# Altium project B100BA.PrjPcb (part 3 of 6)

## Sheet Bidirectional Voltage Translator.SchDoc: 3V3 - 1V8 Voltage Level Translator
size 292 x 193 mm; ApprovedBy: M. Günce Akkoyun; CheckedBy: M. Günce Akkoyun; Author: M. Günce Akkoyun; CompanyName: Ovoo Electronics; DrawnBy: M. Günce Akkoyun; Engineer: M. Günce Akkoyun; Organization: Ovoo Electronics; Address1: Necip Fazıl Mah. Ortaırmak Sok.; Address2: Birgül Apt. No: 19/6; Address3: Meram / Konya; Address4: Turkiye; DocumentNumber: 11; Revision: R01; SheetNumber: 9; SheetTotal: 44
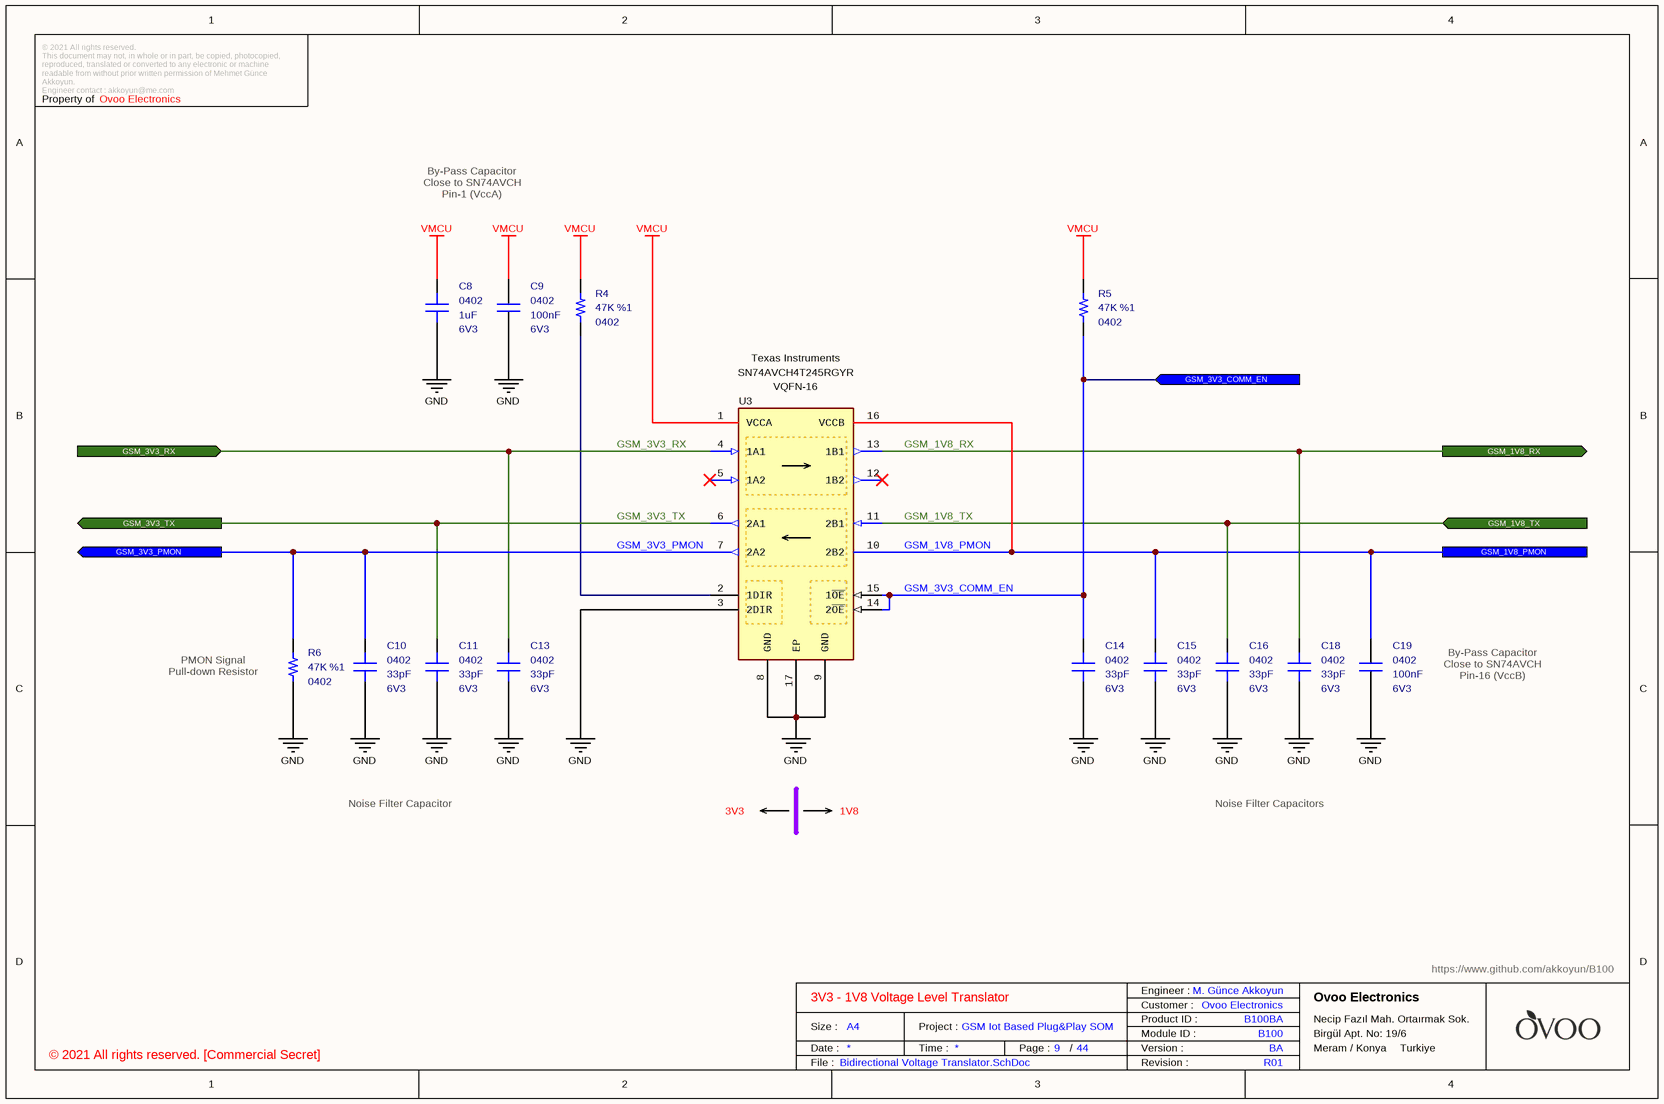
[diagram p12: Bidirectional Voltage Translator.SchDoc]

### Parts
C8  value 1uF  Case: 0402  Voltage: 6V3  [CAPACITOR_0402]  (hidden comment: Multilayer Ceramic Capacitor)
C9  value 100nF  Case: 0402  Voltage: 6V3  [CAPACITOR_0402]  (hidden comment: Multilayer Ceramic Capacitor)
C10  value 33pF  Case: 0402  Voltage: 6V3  [CAPACITOR_0402]  (hidden comment: Multilayer Ceramic Capacitor)
C11  value 33pF  Case: 0402  Voltage: 6V3  [CAPACITOR_0402]  (hidden comment: Multilayer Ceramic Capacitor)
C13  value 33pF  Case: 0402  Voltage: 6V3  [CAPACITOR_0402]  (hidden comment: Multilayer Ceramic Capacitor)
C14  value 33pF  Case: 0402  Voltage: 6V3  [CAPACITOR_0402]  (hidden comment: Multilayer Ceramic Capacitor)
C15  value 33pF  Case: 0402  Voltage: 6V3  [CAPACITOR_0402]  (hidden comment: Multilayer Ceramic Capacitor)
C16  value 33pF  Case: 0402  Voltage: 6V3  [CAPACITOR_0402]  (hidden comment: Multilayer Ceramic Capacitor)
C18  value 33pF  Case: 0402  Voltage: 6V3  [CAPACITOR_0402]  (hidden comment: Multilayer Ceramic Capacitor)
C19  value 100nF  Case: 0402  Voltage: 6V3  [CAPACITOR_0402]  (hidden comment: Multilayer Ceramic Capacitor)
R4  value 47K  Tolerance: %1  Case: 0402  [RESISTOR_0402]  (hidden comment: Thick Film Resistor)
R5  value 47K  Tolerance: %1  Case: 0402  [RESISTOR_0402]  (hidden comment: Thick Film Resistor)
R6  value 47K  Tolerance: %1  Case: 0402  [RESISTOR_0402]  (hidden comment: Thick Film Resistor)
U3  Manufacturer_Name: Texas Instruments  Manufacturer Part Number: SN74AVCH4T245RGYR  Case: VQFN-16  [VQFN16]  (hidden comment: Voltage Level Shifter)

### Ports
GSM_1V8_PMON, GSM_1V8_RX (out), GSM_1V8_TX (in), GSM_3V3_COMM_EN (in), GSM_3V3_PMON (out), GSM_3V3_RX (in), GSM_3V3_TX (out)

### Nets
GND: C8.1 C9.1 C10.1 C11.1 C13.1 C14.1 C15.1 C16.1 C18.1 C19.1 R6.1 U3.3(2DIR) U3.8(GND) U3.9(GND) U3.17(EP)
VMCU: C8.2 C9.2 R4.2 R5.2 U3.1(VCCA)
GSM_1V8_PMON: C15.2 C19.2 U3.10(2B2) U3.16(VCCB) ; port GSM_1V8_PMON
GSM_1V8_RX: C18.2 U3.13(1B1) ; port GSM_1V8_RX
GSM_1V8_TX: C16.2 U3.11(2B1) ; port GSM_1V8_TX
GSM_3V3_COMM_EN: C14.2 R5.1 U3.14(2~{OE}) U3.15(1~{OE}) ; port GSM_3V3_COMM_EN
GSM_3V3_PMON: C10.2 R6.2 U3.7(2A2) ; port GSM_3V3_PMON
GSM_3V3_RX: C13.2 U3.4(1A1) ; port GSM_3V3_RX
GSM_3V3_TX: C11.2 U3.6(2A1) ; port GSM_3V3_TX
NetR4_1: R4.1 U3.2(1DIR)

Not connected (* = marked no-connect by the designer): U3 5(1A2)* 12(1B2)*

### Notes on the sheet
- By-Pass Capacitor
  Close to SN74AVCH
  Pin-1 (VccA)
- (near R6) PMON Signal
  Pull-down Resistor
- By-Pass Capacitor
  Close to SN74AVCH
  Pin-16 (VccB)
- Noise Filter Capacitor
- 3V3
- 1V8
- Noise Filter Capacitors
- © 2021 All rights reserved.
  This document may not, in whole or in part, be copied, photocopied, reproduced, translated or converted to any electronic or machine readable from without prior written permission of Mehmet Günce Akkoyun.
  Engineer contact : akkoyun@me.com
- Property of
- Engineer :
- Date :
- Size :
- A4
- Time :
- Project :
- Page :
- /
- Customer :
- Product ID :
- Module ID :
- Version :
- File :
- Revision :

### Library data of the parts
C8 = Capacitor - 1uF [0402-6V3): Capacitor - 1uF [0402] (Ceramic); Manufacturer_Name: Murata Electronics; Manufacturer_Part_Number: GRM153R60J105ME95D; Dielectric: X5R; Tolerance: 20%; Height: 0.3mm; Mouser_Part_Number: 81-GRM153R60J105ME5D; Maximum Operating Temperature: +85; Minimum Operating Temperature: -55; RoHS: Yes; Weight: 6mg; ComponentLink1Description: DataSheet; ComponentLink1URL: https://psearch.en.murata.com/capacitor/product/GRM153R60J105ME95%23.html; ComponentLink2Description: Mouser; ComponentLink2URL: https://www.mouser.com/Search/Refine.aspx?Keyword=81-GRM153R60J105ME5D; Supplier 1: Future Electronics; Supplier 2: Future Electronics; Supplier 3: Mouser; Supplier 4: Arrow; Supplier 5: Digi-Key; Supplier Part Number 5: 490-14576-1-ND; Supplier Part Number 4: GRM153R60J105ME95D; Supplier Part Number 3: 81-GRM153R60J105ME5D; Supplier Part Number 2: GRM153R60J105ME95D-REEL; Supplier Part Number 1: GRM153R60J105ME95D-CUTT
C9 C19 = Capacitor - 100nF [0402-6V3]: Capacitor - 100nF [0402-6V3] (Ceramic); Manufacturer_Name: AVX; Manufacturer_Part_Number: 04026D104KAT4A; Dielectric: X5R; Tolerance: %10; Height: 0.25mm; Mouser_Part_Number: 581-04026D104KAT4A; ComponentLink1Description: Mouser; ComponentLink1URL: https://www.mouser.com.tr/ProductDetail/AVX/04026D104KAT4A?qs=sGAEpiMZZMs0AnBnWHyRQPg4iYkCw7IMED%2F4kpqgf7w%3D; ComponentLink2Description: DataSheet; ComponentLink2URL: https://www.mouser.com.tr/datasheet/2/40/cx5r-776519.pdf; ROHS: Yes; Maximum Operating Temperature: +85; Minimum Operating Temperature: -55; Supplier 1: Avnet; Supplier Part Number 1: 04026D104KAT4A
C10 C11 C13-C16 C18 = Capacitor - 33pF [0402-6V3]: Capacitor - 33pF [0402] (Ceramic); Manufacturer_Name: Kemet; Manufacturer_Part_Number: C0402C330J9RACAUTO; Dielectric: X7R; Tolerance: 10%; Height: 0.5mm; Mouser_Part_Number: 80-C0402C330J9RAUTO; Maximum Operating Temperature: +125; Minimum Operating Temperature: -55; ROHS: Yes; ComponentLink1Description: DataSheet; ComponentLink1URL: https://api.kemet.com/component-edge/download/datasheet/C0402C330J9RACAUTO.pdf; ComponentLink2Description: Mouser; ComponentLink2URL: https://www.mouser.com/Search/Refine.aspx?Keyword=80-C0402C330J9RAUTO; Supplier 1: Mouser; Supplier Part Number 1: 80-C0402C330J9RAUTO
R4-R6 = Resistor - 47K: Thick Film Resistors - SMD 1/16 W 47 Kohms 1%; Manufacturer_Name: Vishay; Manufacturer_Part_Number: CRCW040247K0FKED; Height: 0.4mm; Mouser_Part_Number: 71-CRCW0402-47K-E3; ComponentLink1Description: DataSheet; ComponentLink1URL: https://www.mouser.com.tr/datasheet/2/427/dcrcwe3-1762152.pdf; ComponentLink2Description: Mouser; ComponentLink2URL: https://www.mouser.com.tr/ProductDetail/Vishay-Dale/CRCW040247K0FKED?qs=sGAEpiMZZMu61qfTUdNhG2DpbjADlD3GL%252B3h1elTxqU%3D; Supplier 1: Mouser; Supplier 2: Digi-Key; Supplier Part Number 1: 71-CRCW040247K0FKEDH; Supplier Part Number 2: 541-47.0KYCT-ND
U3 = IC - SN74AVCH4T245: Translation - Voltage Levels Low Power Dual Channel; Supply Voltage - Max: 3.6V; Supply Voltage - Min: 1.2V; Height: 1mm; Mouser_Part_Number: 595-SN74AVCH4T245RGY; ComponentLink1Description: DataSheet; ComponentLink1URL: http://www.ti.com/general/docs/suppproductinfo.tsp?distId=26&gotoUrl=http%3A%2F%2Fwww.ti.com%2Flit%2Fgpn%2Fsn74avch4t245; Maximum Operating Temperature: +85; Minimum Operating Temperature: -40; ComponentLink2Description: Mouser; ComponentLink2URL: https://www.mouser.com.tr/ProductDetail/Texas-Instruments/SN74AVCH4T245RGYR?qs=PVVDbbWpW3IMTHF1QV2g%252BQ==; Supplier 1: Mouser; Supplier 2: Arrow; Supplier 3: Digi-Key; Supplier Part Number 1: 595-SN74AVCH4T245RGY; Supplier Part Number 2: SN74AVCH4T245RGYR; Supplier Part Number 3: 296-18262-1-ND

## Sheet GSM LED Driver.SchDoc: GSM LED Inducators Driver
size 393 x 281 mm; SheetNumber: 13; SheetTotal: 44
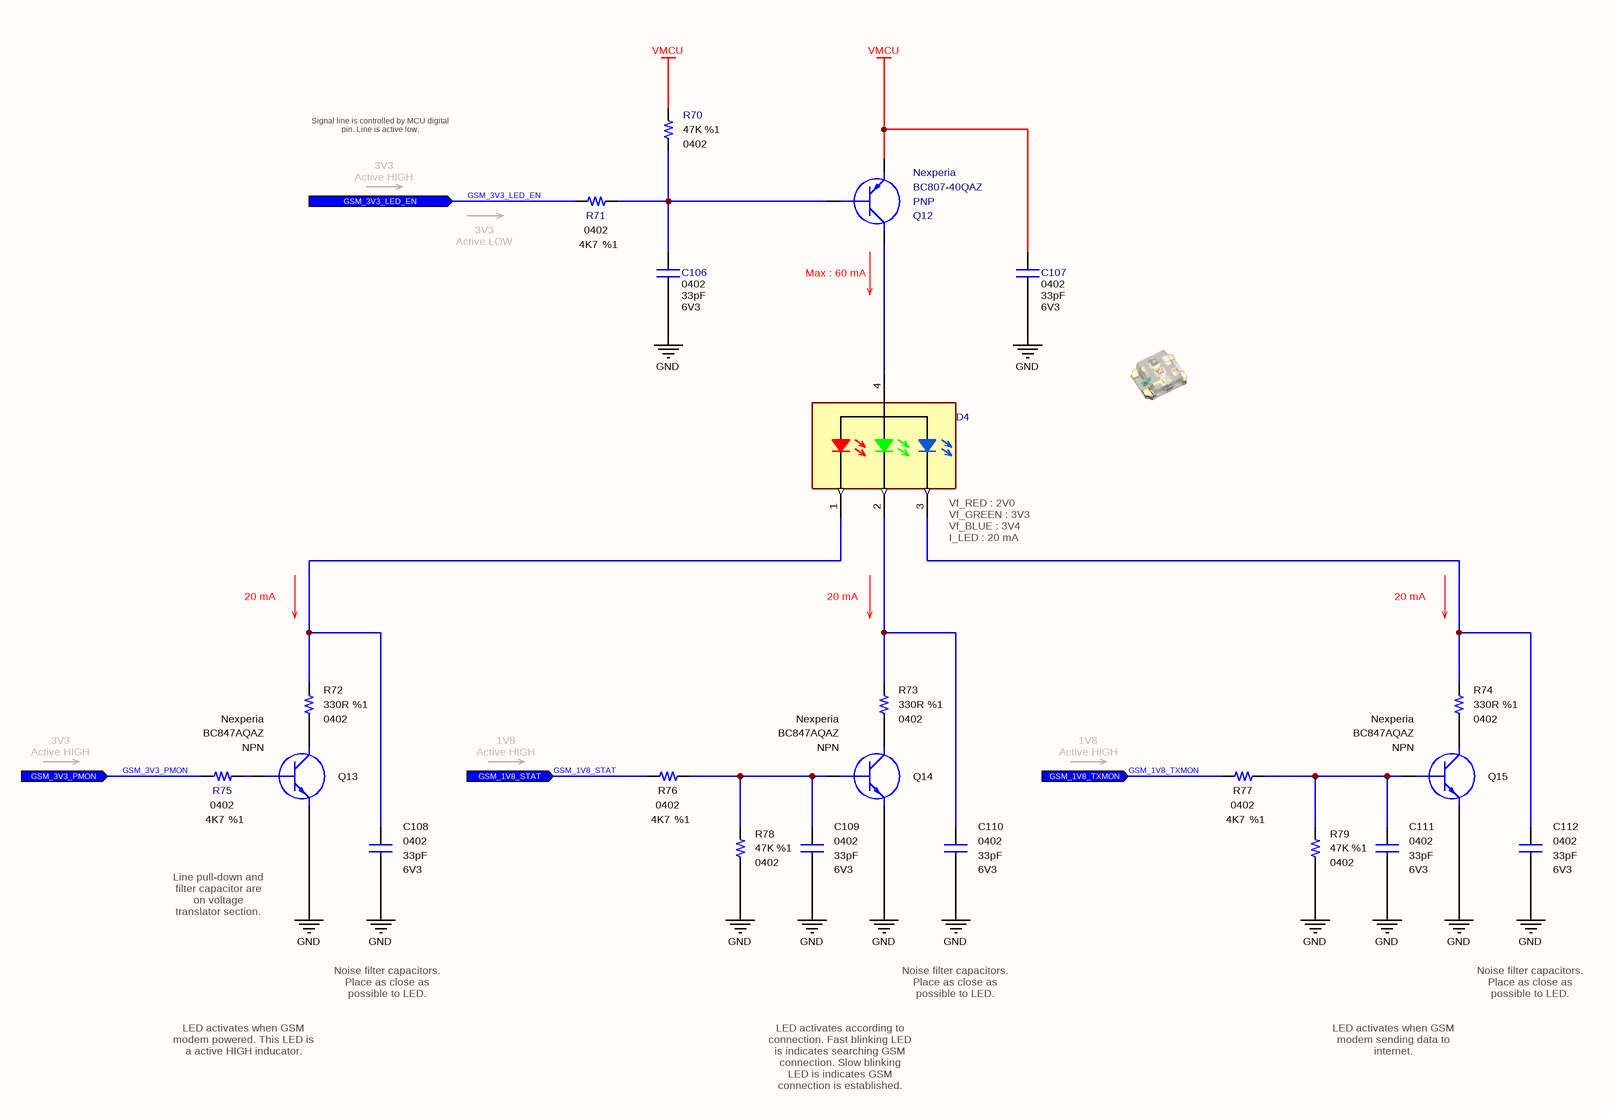
[diagram p13: GSM LED Driver.SchDoc]

### Parts
C106  value 33pF  Case: 0402  Voltage: 6V3  [CAPACITOR_0402]  (hidden comment: Multilayer Ceramic Capacitor)
C107  value 33pF  Case: 0402  Voltage: 6V3  [CAPACITOR_0402]  (hidden comment: Multilayer Ceramic Capacitor)
C108  value 33pF  Case: 0402  Voltage: 6V3  [CAPACITOR_0402]  (hidden comment: Multilayer Ceramic Capacitor)
C109  value 33pF  Case: 0402  Voltage: 6V3  [CAPACITOR_0402]  (hidden comment: Multilayer Ceramic Capacitor)
C110  value 33pF  Case: 0402  Voltage: 6V3  [CAPACITOR_0402]  (hidden comment: Multilayer Ceramic Capacitor)
C111  value 33pF  Case: 0402  Voltage: 6V3  [CAPACITOR_0402]  (hidden comment: Multilayer Ceramic Capacitor)
C112  value 33pF  Case: 0402  Voltage: 6V3  [CAPACITOR_0402]  (hidden comment: Multilayer Ceramic Capacitor)
D4  150066M153000  [Wurth_0606]  (value not drawn)
Q12  Polarity: PNP  Manufacturer Name: Nexperia  Manufacturer Part Number: BC807-40QAZ  [SOT1215]  (hidden comment: Bipolar PNP Transistors)
Q13  Polarity: NPN  Manufacturer Name: Nexperia  [SOT1215]  (hidden comment: BC847AQAZ)
Q14  Polarity: NPN  Manufacturer Name: Nexperia  [SOT1215]  (hidden comment: BC847AQAZ)
Q15  Polarity: NPN  Manufacturer Name: Nexperia  [SOT1215]  (hidden comment: BC847AQAZ)
R70  value 47K  Tolerance: %1  Case: 0402  [RESISTOR_0402]  (hidden comment: 47K - 0402 - %1 - 1/16W)
R71  value 4K7  Tolerance: %1  Case: 0402  [RESISTOR_0402]  (hidden comment: Thick Film Resistor)
R72  value 330R  Case: 0402  Tolerance: %1  [RESISTOR_0402]  (hidden comment: 330R - 0402 - %1 - 1/16W)
R73  value 330R  Case: 0402  Tolerance: %1  [RESISTOR_0402]  (hidden comment: 330R - 0402 - %1 - 1/16W)
R74  value 330R  Case: 0402  Tolerance: %1  [RESISTOR_0402]  (hidden comment: 330R - 0402 - %1 - 1/16W)
R75  value 4K7  Tolerance: %1  Case: 0402  [RESISTOR_0402]  (hidden comment: Thick Film Resistor)
R76  value 4K7  Tolerance: %1  Case: 0402  [RESISTOR_0402]  (hidden comment: Thick Film Resistor)
R77  value 4K7  Tolerance: %1  Case: 0402  [RESISTOR_0402]  (hidden comment: Thick Film Resistor)
R78  value 47K  Tolerance: %1  Case: 0402  [RESISTOR_0402]  (hidden comment: 47K - 0402 - %1 - 1/16W)
R79  value 47K  Tolerance: %1  Case: 0402  [RESISTOR_0402]  (hidden comment: 47K - 0402 - %1 - 1/16W)

### Ports
GSM_1V8_STAT (in), GSM_1V8_TXMON (in), GSM_3V3_LED_EN (in), GSM_3V3_PMON (in)

### Nets
GND: C106.2 C107.2 C108.2 C109.2 C110.2 C111.2 C112.2 Q13.2(E) Q14.2(E) Q15.2(E) R78.1 R79.1
VMCU: C107.1 Q12.2(E) R70.2
GSM_1V8_STAT: R76.2 ; port GSM_1V8_STAT
GSM_1V8_TXMON: R77.2 ; port GSM_1V8_TXMON
GSM_3V3_LED_EN: R71.2 ; port GSM_3V3_LED_EN
GSM_3V3_PMON: R75.2 ; port GSM_3V3_PMON
NetC106_1: C106.1 Q12.1(B) R70.1 R71.1
NetC108_1: C108.1 D4.1 R72.2
NetC109_1: C109.1 Q14.1(B) R76.1 R78.2
NetC110_1: C110.1 D4.2 R73.2
NetC111_1: C111.1 Q15.1(B) R77.1 R79.2
NetC112_1: C112.1 D4.3 R74.2
NetD4_4: D4.4 Q12.3(C)
NetQ13_1: Q13.1(B) R75.1
NetQ13_3: Q13.3(C) R72.1
NetQ14_3: Q14.3(C) R73.1
NetQ15_3: Q15.3(C) R74.1

### Notes on the sheet
- Signal line is controlled by MCU digital pin. Line is active low.
- 3V3
  Active HIGH
- 3V3
  Active LOW
- (near Q12) Max : 60 mA
- (near D4) Vf_RED : 2V0
  Vf_GREEN : 3V3
  Vf_BLUE : 3V4
  I_LED : 20 mA
- 20 mA
- 1V8
  Active HIGH
- Line pull-down and filter capacitor are on voltage translator section.
- Noise filter capacitors. Place as close as possible to LED.
- LED activates when GSM modem powered. This LED is a active HIGH inducator.
- LED activates according to connection. Fast blinking LED is indicates searching GSM connection. Slow blinking LED is indicates GSM connection is established.
- LED activates when GSM modem sending data to internet.
- © 2021 All rights reserved.
  This document may not, in whole or in part, be copied, photocopied, reproduced, translated or converted to any electronic or machine readable from without prior written permission of Mehmet Günce Akkoyun.
  Engineer contact : akkoyun@me.com
- Property of
- Engineer :
- Date :
- Size :
- A3
- Time :
- Project :
- Page :
- /
- Customer :
- Product ID :
- Module ID :
- Version :
- File :
- Revision :

### Library data of the parts
C106-C112 = Capacitor - 33pF [0402-6V3]: as C66 on sheet 3V8 Buck Boost Converter; Height: 0.5mm; Maximum Operating Temperature: +125; Minimum Operating Temperature: -55; ROHS: Yes; ComponentLink1Description: DataSheet; ComponentLink1URL: https://api.kemet.com/component-edge/download/datasheet/C0402C330J9RACAUTO.pdf; ComponentLink2Description: Mouser; ComponentLink2URL: https://www.mouser.com/Search/Refine.aspx?Keyword=80-C0402C330J9RAUTO; Supplier 1: Mouser; Supplier Part Number 1: 80-C0402C330J9RAUTO; Mouser Part Number: 80-C0402C330J9RAUTO
D4 = Diode - RGB LED (150066M153000): Standard LEDs - SMD PICOLED series Red LED; Manufacturer Name: Wurth Elektronik; Datasheet Link: https://www.mouser.com.tr/datasheet/2/445/150066M153000-1715259.pdf; Manufacturer Part Number: 150066M153000; Mouser Part Number: 710-150066M153000; Mouser Price/Stock: https://www.mouser.com.tr/ProductDetail/ROHM-Semiconductor/SML-P12U2TT86R?qs=sGAEpiMZZMseGfSY3csMkRIBDsfU3UCXJTULB5gem9Ta%252Bp%252BvZ709fg%3D%3D; Case: 0606; ROHS: Yes; Supplier 1: RSComponents; Supplier 2: RSComponents; Supplier 3: Mouser; Supplier 4: Farnell; Supplier 5: Digi-Key; Supplier 6: Digi-Key; Supplier 7: Digi-Key; Supplier 8: Newark; Supplier Part Number 1: 1765006; Supplier Part Number 2: 1766050; Supplier Part Number 3: 710-150066M153000; Supplier Part Number 4: 2764964; Supplier Part Number 5: 732-11390-1-ND; Supplier Part Number 6: 732-11390-6-ND; Supplier Part Number 7: 732-11390-2-ND; Supplier Part Number 8: 22AC3253
Q12 = Transistor - BC807: Bipolar Transistors - BJT 45 V, 500 mA PNP gen purpose transistors; Mouser Part Number: 771-BC807-40QAZ; ComponentLink1Description: DataSheet; ComponentLink1URL: https://www.mouser.com.tr/datasheet/2/916/BC807-25QA_40QA-1665956.pdf; ComponentLink2Description: Mouser; ComponentLink2URL: https://www.mouser.com.tr/ProductDetail/Nexperia/BC807-40QAZ?qs=sGAEpiMZZMshyDBzk1%2FWi8mfWMj7sMzapbI3Mu1S6AqR9y7krhZTdA%3D%3D; Supplier 1: Mouser; Supplier 2: Arrow; Supplier 3: Digi-Key; Supplier 4: Digi-Key; Supplier Part Number 1: 771-BC807-40QAZ; Supplier Part Number 2: BC807-40QAZ; Supplier Part Number 3: 1727-2242-1-ND; Supplier Part Number 4: 1727-2242-6-ND; Case: DFN-1010D-3
Q13-Q15 = Transistor - BC847: Bipolar NPN Transistors; Case: DFN-1010D-3; Supplier 1: Digi-Key; Supplier 2: Digi-Key; Supplier Part Number 1: 1727-2545-1-ND; Supplier Part Number 2: 1727-2545-6-ND; Manufacturer Part Number: BC847AQAZ; Supplier 3: Avnet; Supplier 4: Arrow Electronics; Supplier 5: Mouser; Supplier 6: Newark; Supplier 7: Digi-Key; Supplier 8: Farnell; Supplier 9: Farnell; Supplier Part Number 3: BC847AQAZ; Supplier Part Number 4: BC847AQAZ; Supplier Part Number 5: 771-BC847AQAZ; Supplier Part Number 6: 82Y6125; Supplier Part Number 7: 1727-2545-2-ND; Supplier Part Number 8: 2545344; Supplier Part Number 9: 2545344RL
R70 R78 R79 = Resistor - 47K: Thick Film Resistors - SMD 1/16 W 47 Kohms 1%; Manufacturer Name: Vishay; Manufacturer Part Number: CRCW040247K0FKED; Height: 0.4mm; ComponentLink1Description: DataSheet; ComponentLink1URL: https://www.mouser.com.tr/datasheet/2/427/dcrcwe3-1762152.pdf; ComponentLink2Description: Mouser; ComponentLink2URL: https://www.mouser.com.tr/ProductDetail/Vishay-Dale/CRCW040247K0FKED?qs=sGAEpiMZZMu61qfTUdNhG2DpbjADlD3GL%252B3h1elTxqU%3D; Supplier 1: RSComponents; Supplier 2: Newark; Supplier Part Number 1: 6789361P; Supplier Part Number 2: 52K7097; Supplier 3: Avnet; Supplier 4: RSComponents; Supplier 5: Future Electronics; Supplier 6: Future Electronics; Supplier 7: Newark; Supplier 8: Arrow Electronics; Supplier 9: Mouser; Supplier 10: Newark; Supplier 11: Avnet; Supplier 12: Digi-Key; Supplier 13: Digi-Key; Supplier 14: Digi-Key; Supplier 15: Newark; Supplier 16: Farnell; Supplier 17: Farnell; Supplier 18: Farnell; Supplier 19: Allied Electronics; Supplier 20: Allied Electronics; Supplier 21: Avnet; Supplier 22: Future Electronics; Supplier 23: Future Electronics; Supplier 24: Future Electronics; Supplier 25: Newark; Supplier 26: RSComponents; Supplier 27: RSComponents; Supplier Part Number 3: 52K7097; Supplier Part Number 4: 6789361; Supplier Part Number 5: 2103738; Supplier Part Number 6: 7521222; Supplier Part Number 7: 42K3500; Supplier Part Number 8: CRCW040247K0FKED; Supplier Part Number 12: 541-47.0KLCT-ND; Supplier Part Number 14: 541-47.0KLTR-ND; Supplier Part Number 10: 61M5310; Supplier Part Number 9: 71-CRCW0402-47K-E3; Supplier Part Number 13: 541-47.0KLDKR-ND; Supplier Part Number 11: CRCW040247K0FKED; Supplier Part Number 15: 25AC7165; Supplier Part Number 16: 1469719; Supplier Part Number 18: 2121814; Supplier Part Number 17: 1469719RL; Supplier Part Number 19: 70202660; Supplier Part Number 20: 70272767; Supplier Part Number 21: 42K3500; Supplier Part Number 22: 6128776; Supplier Part Number 24: CRCW040247K0FKED-REEL; Supplier Part Number 23: CRCW040247K0FKED-CUTT; Supplier Part Number 25: 24W2315; Supplier Part Number 26: 1688455; Supplier Part Number 27: 1823505
R71 R75-R77 = Resistor - 4K7: Thick Film Resistors - SMD 1/16 W 4.7 Kohms 1%; Manufacturer Name: Vishay; Manufacturer Part Number: CRCW04024K70FKED; Height: 0.4mm; Mouser Part Number: 71-CRCW0402-4.7K-E3; ComponentLink1Description: DataSheet; ComponentLink1URL: https://www.mouser.com.tr/datasheet/2/427/dcrcwe3-1762152.pdf; ComponentLink2Description: Mouser; ComponentLink2URL: https://www.mouser.com.tr/ProductDetail/Vishay-Dale/CRCW04024K70FKED?qs=sGAEpiMZZMu61qfTUdNhG7nHf%2F6MTUn3HadIdDQu24Q%3D; Supplier 1: Mouser; Supplier 2: Digi-Key; Supplier Part Number 2: 541-4.70KLCT-ND; Supplier Part Number 1: 71-CRCW0402-4.7K-E3
R72-R74 = Resistor - 330R: Thick Film Resistors - SMD 1/16 W 330 Ohm 1%; Manufacturer Name: Vishay; Manufacturer Part Number: CRCW0402330RFKED; Height: 0.4mm; Mouser Part Number: 71-CRCW0402-330-E3; ComponentLink1Description: DataSheet; ComponentLink1URL: https://www.mouser.com.tr/datasheet/2/427/dcrcwe3-1762152.pdf; ComponentLink2Description: Mouser; ComponentLink2URL: https://www.mouser.com.tr/ProductDetail/Vishay-Dale/CRCW0402330RFKED?qs=sGAEpiMZZMu61qfTUdNhG2DpbjADlD3GGS6SwBlLi5Q%3D; Supplier 1: Digi-Key; Supplier 2: Digi-Key; Supplier 3: Digi-Key; Supplier 4: Newark; Supplier 5: Newark; Supplier 6: RSComponents; Supplier 7: RSComponents; Supplier 8: Future Electronics; Supplier 9: Future Electronics; Supplier 10: Newark; Supplier 11: Newark; Supplier 12: Arrow Electronics; Supplier 13: Mouser; Supplier 14: Avnet; Supplier 15: Farnell; Supplier 16: Farnell; Supplier 17: Farnell; Supplier 18: Allied Electronics; Supplier 19: Allied Electronics; Supplier 20: Avnet; Supplier 21: Avnet; Supplier 22: Future Electronics; Supplier 23: Future Electronics; Supplier 24: Newark; Supplier 25: RSComponents; Supplier 26: RSComponents; Supplier Part Number 1: 541-330LCT-ND; Supplier Part Number 2: 541-330LDKR-ND; Supplier Part Number 3: 541-330LTR-ND; Supplier Part Number 4: 52K6981; Supplier Part Number 5: 61M5301; Supplier Part Number 6: 6789178P; Supplier Part Number 7: 6789178; Supplier Part Number 9: 9848185; Supplier Part Number 8: 4103726; Supplier Part Number 10: 25AC7117; Supplier Part Number 11: 42K3473; Supplier Part Number 26: 1819488; Supplier Part Number 25: 1688408; Supplier Part Number 24: 24W2220; Supplier Part Number 23: CRCW0402330RFKED-REEL; Supplier Part Number 22: CRCW0402330RFKED-CUTT; Supplier Part Number 21: 52K6981; Supplier Part Number 20: 42K3473; Supplier Part Number 19: 70272759; Supplier Part Number 18: 70202255; Supplier Part Number 17: 1469709RL; Supplier Part Number 16: 2121540; Supplier Part Number 15: 1469709; Supplier Part Number 14: CRCW0402330RFKED; Supplier Part Number 13: 71-CRCW0402-330-E3; Supplier Part Number 12: CRCW0402330RFKED

## Sheet MicroController.SchDoc: MicroController Block Diagram
size 393 x 281 mm; ApprovedBy: M. Günce Akkoyun; CheckedBy: M. Günce Akkoyun; CompanyName: Ovoo Electronics; DrawnBy: M. Günce Akkoyun; Engineer: M. Günce Akkoyun; Organization: Ovoo Electronics; Address1: Necip Fazıl Mah. Ortaırmak Sok.; Address2: Birgül Apt. No: 19/6; Address3: Meram / Konya; Address4: Turkiye; DocumentNumber: 14; Revision: R01; SheetNumber: 15; SheetTotal: 44
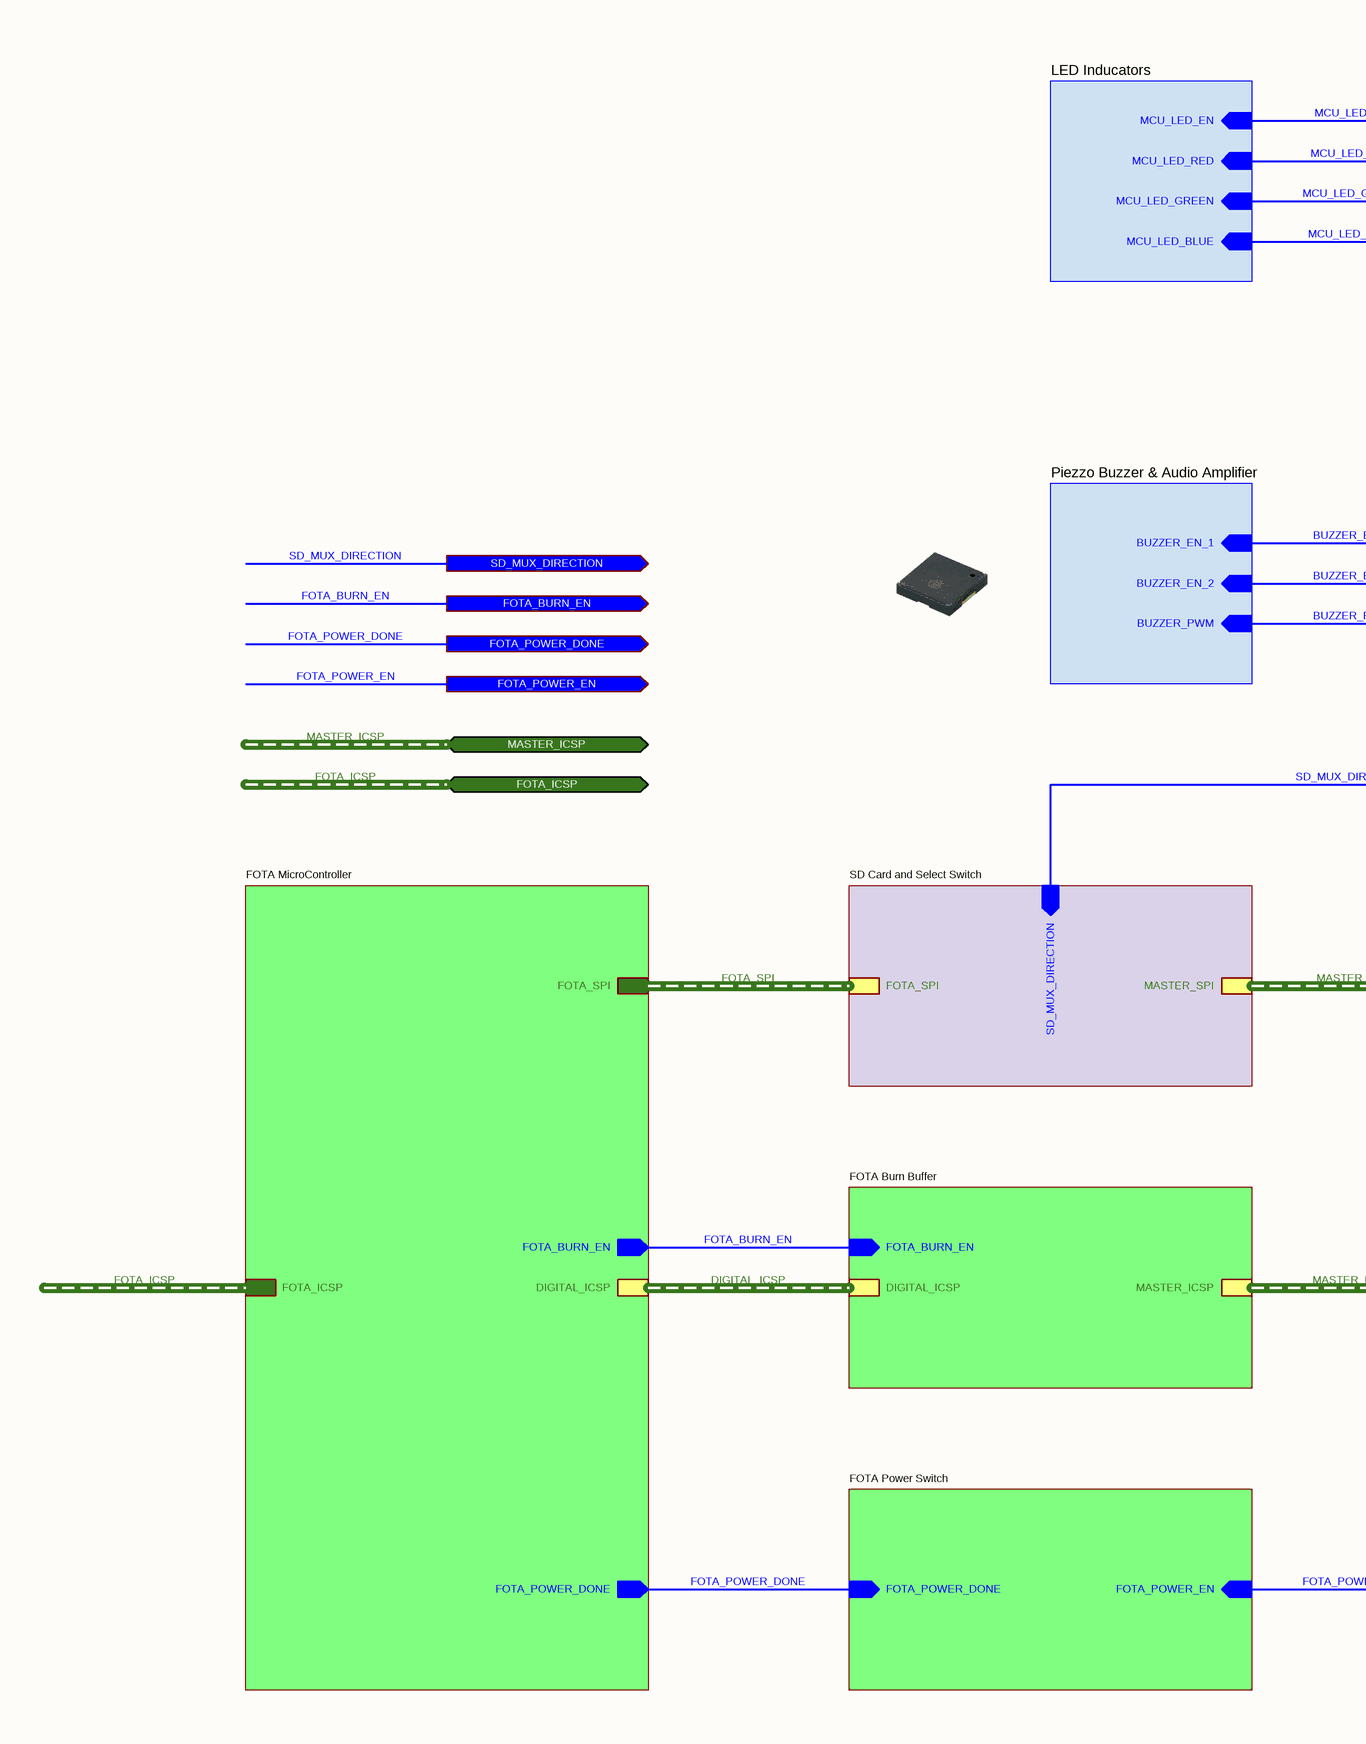
[diagram p14: MicroController.SchDoc, left]
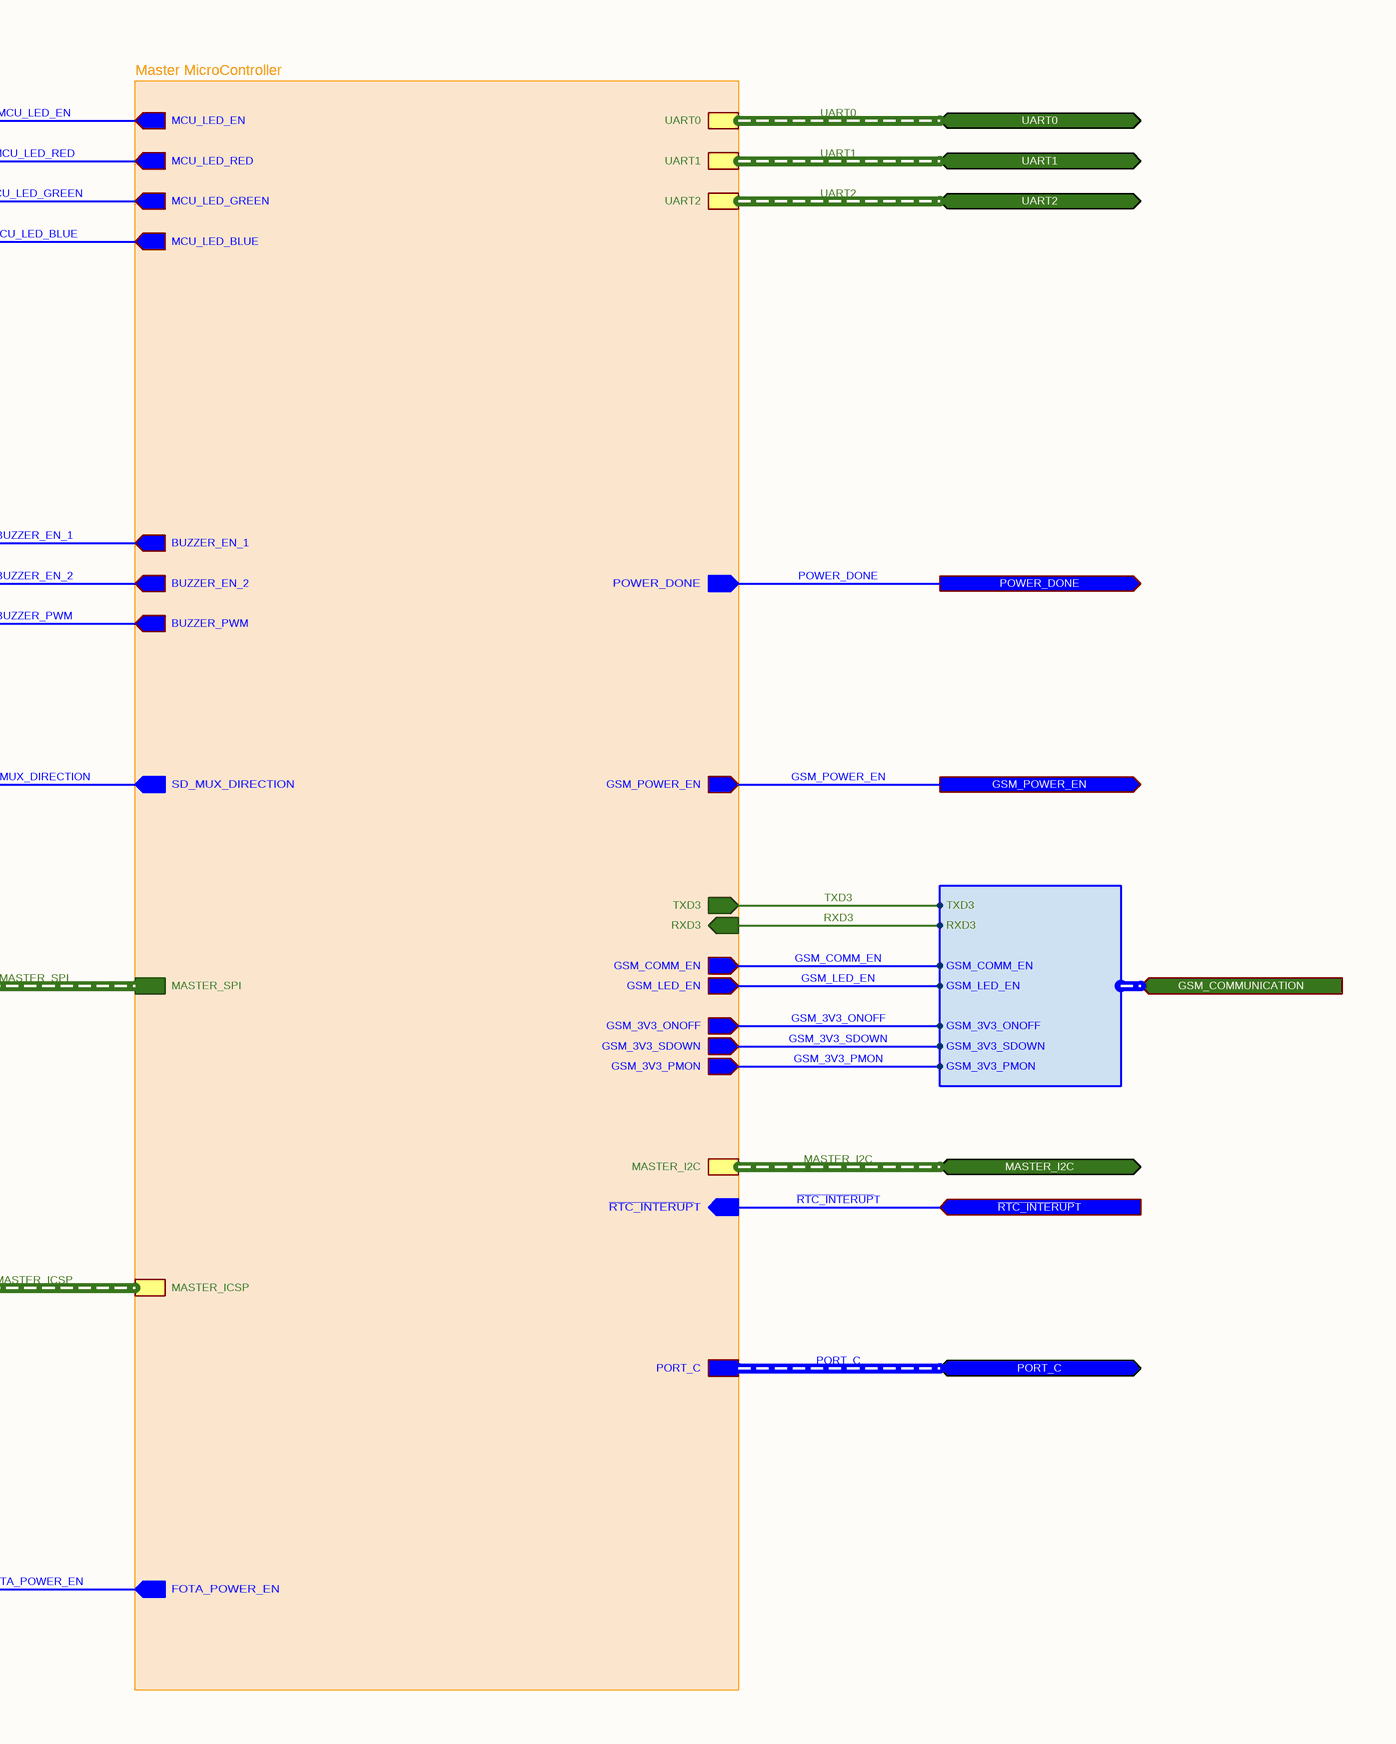
[diagram p15: MicroController.SchDoc, right]

### Sub-sheets
FOTA Burn Buffer = FOTA Burn Buffer.SchDoc: FOTA_BURN_EN (in), MASTER_ICSP (harness MASTER_ICSP), DIGITAL_ICSP (harness DIGITAL_ICSP)
FOTA MicroController = FOTA MicroController Block Diagram.SchDoc: FOTA_ICSP (harness FOTA_ICSP), FOTA_POWER_DONE (out), FOTA_SPI (harness FOTA_SPI), FOTA_BURN_EN (out), DIGITAL_ICSP (harness DIGITAL_ICSP)
FOTA Power Switch = FOTA MicroController Power Switch.SchDoc: FOTA_POWER_EN (in), FOTA_POWER_DONE (in)
LED Inducators = Master MicroController LED.SchDoc: MCU_LED_RED (in), MCU_LED_BLUE (in), MCU_LED_GREEN (in), MCU_LED_EN (in)
Master MicroController = Master MicroController.SchDoc: FOTA_POWER_EN (out), POWER_DONE (out), ~{RTC_INTERUP}T (in), SD_MUX_DIRECTION (out), UART1 (harness UART1), UART0 (harness UART0), MASTER_ICSP (harness MASTER_ICSP), UART2 (harness UART2), MASTER_I2C (harness MASTER_I2C), MASTER_SPI (harness MASTER_SPI), MCU_LED_BLUE (out), PORT_C (harness PORT_C), GSM_LED_EN (out), GSM_3V3_ONOFF (out), GSM_3V3_PMON (out), BUZZER_EN_2 (out), GSM_3V3_SDOWN (out), BUZZER_PWM (out), MCU_LED_RED (out), GSM_POWER_EN (out), MCU_LED_GREEN (out), GSM_COMM_EN (out), BUZZER_EN_1 (out), MCU_LED_EN (out), RXD3 (in), TXD3 (out)
Piezzo Buzzer & Audio Amplifier = Buzzer.SchDoc: BUZZER_EN_1 (in), BUZZER_PWM (in), BUZZER_EN_2 (in)
SD Card and Select Switch = SD Card.SchDoc: SD_MUX_DIRECTION (in), FOTA_SPI (harness FOTA_SPI), MASTER_SPI (harness MASTER_SPI)

### Ports
FOTA_BURN_EN (out), FOTA_ICSP (bidir, harness FOTA_ICSP), FOTA_POWER_DONE (out), FOTA_POWER_EN (out), GSM_COMMUNICATION (in, harness GSM_COMMUNICATION), GSM_POWER_EN (out), MASTER_I2C (bidir, harness MASTER_I2C), MASTER_ICSP (bidir, harness MASTER_ICSP), PORT_C (bidir, harness PORT_C), POWER_DONE (out), SD_MUX_DIRECTION (out), UART0 (bidir, harness UART0), UART1 (bidir, harness UART1), UART2 (bidir, harness UART2), ~{RTC_INTERUP}T (in)

### Harnesses
GSM_COMMUNICATION: GSM_3V3_ONOFF, GSM_LED_EN, GSM_COMM_EN, GSM_3V3_SDOWN, GSM_3V3_PMON, RXD3, TXD3

### Nets
~{RTC_INTERUP}T: port ~{RTC_INTERUP}T, sheet Master MicroController/~{RTC_INTERUP}T
BUZZER_EN_1: sheet Master MicroController/BUZZER_EN_1, sheet Piezzo Buzzer & Audio Amplifier/BUZZER_EN_1
BUZZER_EN_2: sheet Master MicroController/BUZZER_EN_2, sheet Piezzo Buzzer & Audio Amplifier/BUZZER_EN_2
BUZZER_PWM: sheet Master MicroController/BUZZER_PWM, sheet Piezzo Buzzer & Audio Amplifier/BUZZER_PWM
FOTA_BURN_EN: port FOTA_BURN_EN, sheet FOTA MicroController/FOTA_BURN_EN, sheet FOTA Burn Buffer/FOTA_BURN_EN
FOTA_POWER_DONE: port FOTA_POWER_DONE, sheet FOTA MicroController/FOTA_POWER_DONE, sheet FOTA Power Switch/FOTA_POWER_DONE
FOTA_POWER_EN: port FOTA_POWER_EN, sheet Master MicroController/FOTA_POWER_EN, sheet FOTA Power Switch/FOTA_POWER_EN
GSM_3V3_ONOFF: sheet Master MicroController/GSM_3V3_ONOFF, port GSM_COMMUNICATION.GSM_3V3_ONOFF
GSM_3V3_PMON: sheet Master MicroController/GSM_3V3_PMON, port GSM_COMMUNICATION.GSM_3V3_PMON
GSM_3V3_SDOWN: sheet Master MicroController/GSM_3V3_SDOWN, port GSM_COMMUNICATION.GSM_3V3_SDOWN
GSM_COMM_EN: sheet Master MicroController/GSM_COMM_EN, port GSM_COMMUNICATION.GSM_COMM_EN  [project net GSM_3V3_COMM_EN]
GSM_LED_EN: sheet Master MicroController/GSM_LED_EN, port GSM_COMMUNICATION.GSM_LED_EN  [project net GSM_3V3_LED_EN]
GSM_POWER_EN: port GSM_POWER_EN, sheet Master MicroController/GSM_POWER_EN
MCU_LED_BLUE: sheet Master MicroController/MCU_LED_BLUE, sheet LED Inducators/MCU_LED_BLUE
MCU_LED_EN: sheet Master MicroController/MCU_LED_EN, sheet LED Inducators/MCU_LED_EN
MCU_LED_GREEN: sheet Master MicroController/MCU_LED_GREEN, sheet LED Inducators/MCU_LED_GREEN
MCU_LED_RED: sheet Master MicroController/MCU_LED_RED, sheet LED Inducators/MCU_LED_RED
POWER_DONE: port POWER_DONE, sheet Master MicroController/POWER_DONE
RXD3: sheet Master MicroController/RXD3, port GSM_COMMUNICATION.RXD3  [project net GSM_3V3_TX]
SD_MUX_DIRECTION: port SD_MUX_DIRECTION, sheet Master MicroController/SD_MUX_DIRECTION, sheet SD Card and Select Switch/SD_MUX_DIRECTION
TXD3: sheet Master MicroController/TXD3, port GSM_COMMUNICATION.TXD3  [project net GSM_3V3_RX]

### Buses and harness runs
harness DIGITAL_ICSP = sheet FOTA Burn Buffer/DIGITAL_ICSP = sheet FOTA MicroController/DIGITAL_ICSP
harness FOTA_ICSP = port FOTA_ICSP
harness FOTA_ICSP = sheet FOTA MicroController/FOTA_ICSP
harness FOTA_SPI = sheet FOTA MicroController/FOTA_SPI = sheet SD Card and Select Switch/FOTA_SPI
harness MASTER_I2C = port MASTER_I2C = sheet Master MicroController/MASTER_I2C
harness MASTER_ICSP = port MASTER_ICSP
harness MASTER_ICSP = sheet FOTA Burn Buffer/MASTER_ICSP = sheet Master MicroController/MASTER_ICSP
harness MASTER_SPI = sheet Master MicroController/MASTER_SPI = sheet SD Card and Select Switch/MASTER_SPI
harness PORT_C = port PORT_C = sheet Master MicroController/PORT_C
harness UART0 = port UART0 = sheet Master MicroController/UART0
harness UART1 = port UART1 = sheet Master MicroController/UART1
harness UART2 = port UART2 = sheet Master MicroController/UART2

### Notes on the sheet
- © 2021 All rights reserved.
  This document may not, in whole or in part, be copied, photocopied, reproduced, translated or converted to any electronic or machine readable from without prior written permission of Mehmet Günce Akkoyun.
  Engineer contact : akkoyun@me.com
- Property of
- Engineer :
- Date :
- Size :
- A3
- Time :
- Project :
- Page :
- /
- Customer :
- Product ID :
- Module ID :
- Version :
- File :
- Revision :

## Sheet Master MicroController.SchDoc: Master Micro Controller
size 393 x 281 mm; ApprovedBy: M. Günce Akkoyun; CheckedBy: M. Günce Akkoyun; Author: M. Günce Akkoyun; CompanyName: Ovoo Electronics; DrawnBy: M. Günce Akkoyun; Engineer: M. Günce Akkoyun; Organization: Ovoo Electronics; Address1: Necip Fazıl Mah. Ortaırmak Sok.; Address2: Birgül Apt. No: 19/6; Address3: Meram / Konya; Address4: Turkiye; DocumentNumber: 13; Revision: R01; SheetNumber: 16; SheetTotal: 44
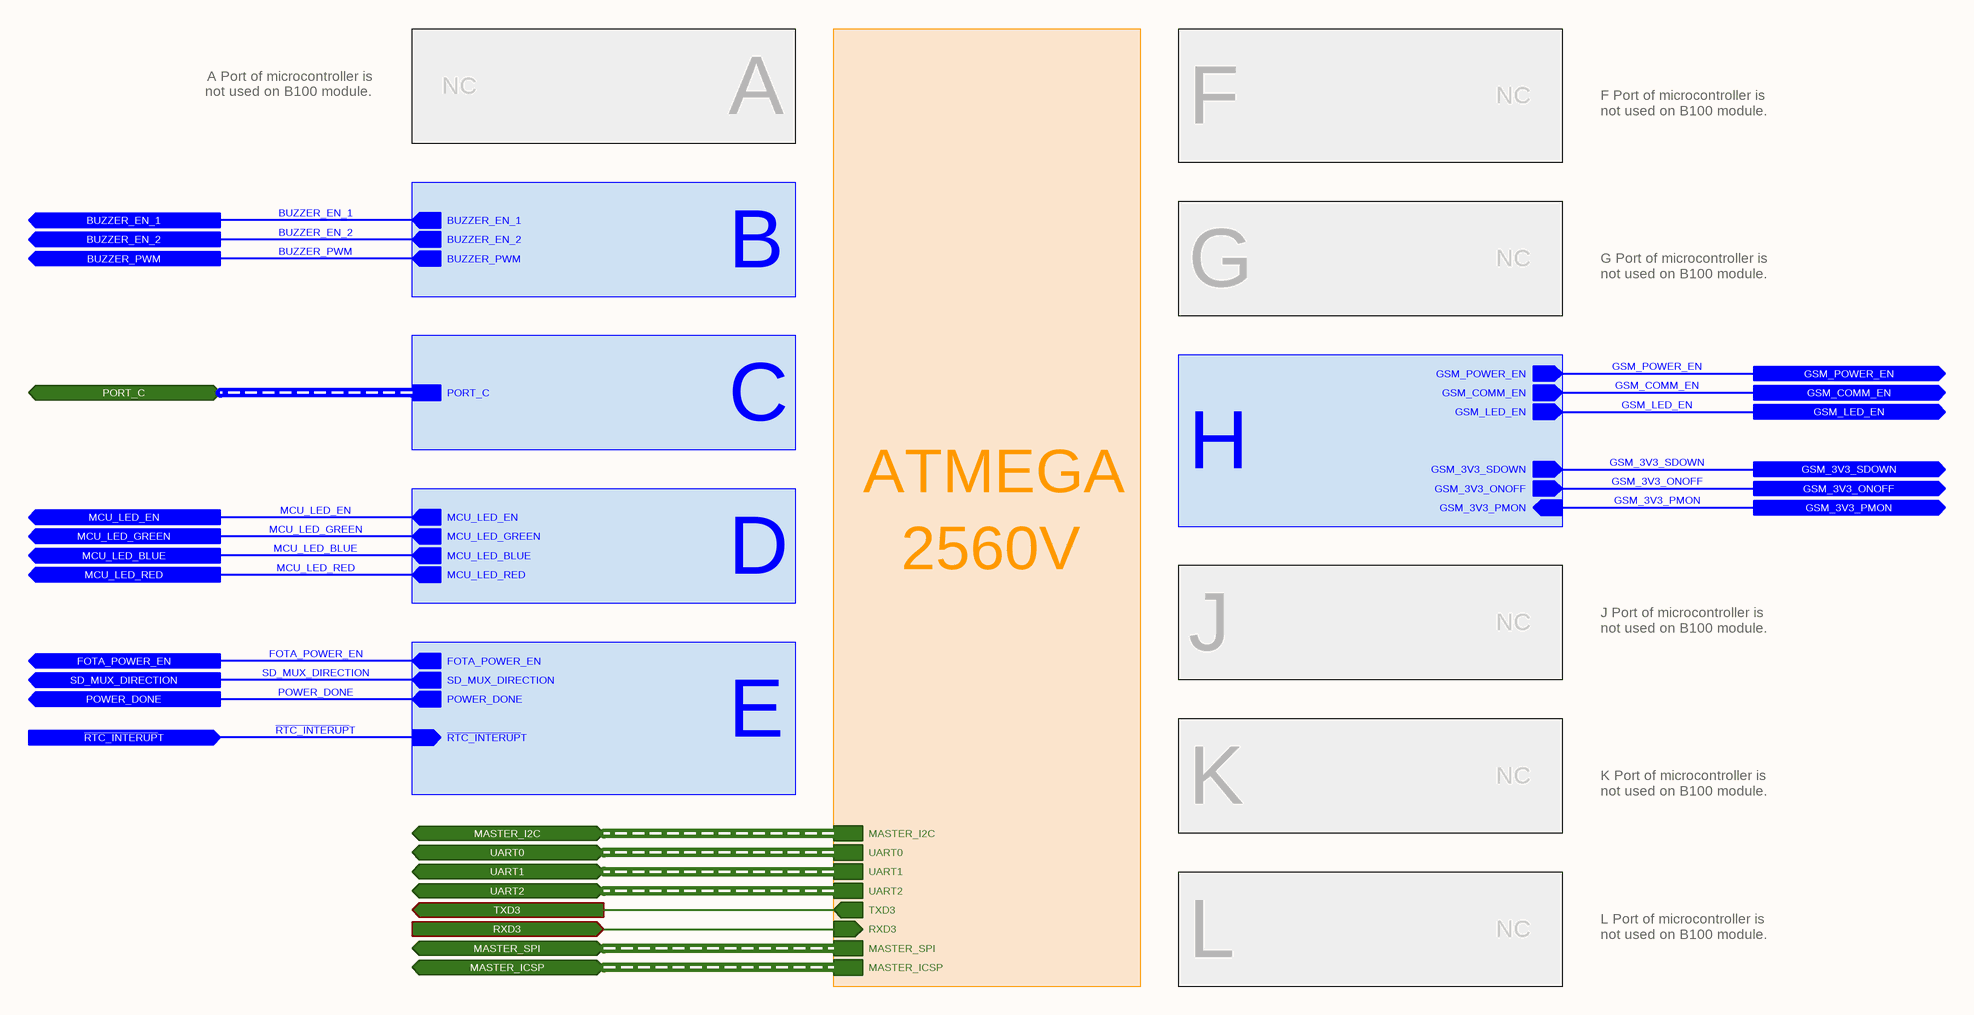
[diagram p16: Master MicroController.SchDoc]

### Sub-sheets
Master MicroController Core = Master MicroController Core.SchDoc: MASTER_I2C (harness MASTER_I2C), MASTER_SPI (harness MASTER_SPI), UART0 (harness UART0), UART1 (harness UART1), UART2 (harness UART2), MASTER_ICSP (harness MASTER_ICSP), TXD3 (out), RXD3 (in)
PORT A = Master MicroController Port A.SchDoc: no entries
PORT B = Master MicroController Port B.SchDoc: BUZZER_EN_2 (out), BUZZER_EN_1 (out), BUZZER_PWM (out)
PORT C = Master MicroController Port C.SchDoc: PORT_C (harness PORT_C)
PORT D = Master MicroController Port D.SchDoc: MCU_LED_EN (out), MCU_LED_GREEN (out), MCU_LED_BLUE (out), MCU_LED_RED (out)
PORT E = Master MicroController Port E.SchDoc: FOTA_POWER_EN (out), SD_MUX_DIRECTION (out), ~{RTC_INTERUP}T (in), POWER_DONE (out)
PORT F = Master MicroController Port F.SchDoc: no entries
PORT G = Master MicroController Port G.SchDoc: no entries
PORT H = Master MicroController Port H.SchDoc: GSM_POWER_EN (out), GSM_3V3_SDOWN (out), GSM_COMM_EN (out), GSM_LED_EN (out), GSM_3V3_ONOFF (out), GSM_3V3_PMON (in)
PORT J = Master MicroController Port J.SchDoc: no entries
PORT K = Master MicroController Port K.SchDoc: no entries
PORT L = Master MicroController Port L.SchDoc: no entries

### Ports
BUZZER_EN_1 (out), BUZZER_EN_2 (out), BUZZER_PWM (out), FOTA_POWER_EN (out), GSM_3V3_ONOFF (out), GSM_3V3_PMON (out), GSM_3V3_SDOWN (out), GSM_COMM_EN (out), GSM_LED_EN (out), GSM_POWER_EN (out), MASTER_I2C (bidir, harness MASTER_I2C), MASTER_ICSP (bidir, harness MASTER_ICSP), MASTER_SPI (bidir, harness MASTER_SPI), MCU_LED_BLUE (out), MCU_LED_EN (out), MCU_LED_GREEN (out), MCU_LED_RED (out), PORT_C (bidir, harness PORT_C), POWER_DONE (out), RXD3 (in), SD_MUX_DIRECTION (out), TXD3 (out), UART0 (bidir, harness UART0), UART1 (bidir, harness UART1), UART2 (bidir, harness UART2), ~{RTC_INTERUP}T (in)

### Nets
~{RTC_INTERUP}T: port ~{RTC_INTERUP}T, sheet PORT E/~{RTC_INTERUP}T
BUZZER_EN_1: port BUZZER_EN_1, sheet PORT B/BUZZER_EN_1
BUZZER_EN_2: port BUZZER_EN_2, sheet PORT B/BUZZER_EN_2
BUZZER_PWM: port BUZZER_PWM, sheet PORT B/BUZZER_PWM
FOTA_POWER_EN: port FOTA_POWER_EN, sheet PORT E/FOTA_POWER_EN
GSM_3V3_ONOFF: port GSM_3V3_ONOFF, sheet PORT H/GSM_3V3_ONOFF
GSM_3V3_PMON: port GSM_3V3_PMON, sheet PORT H/GSM_3V3_PMON
GSM_3V3_RX: port TXD3, sheet Master MicroController Core/TXD3
GSM_3V3_SDOWN: port GSM_3V3_SDOWN, sheet PORT H/GSM_3V3_SDOWN
GSM_3V3_TX: port RXD3, sheet Master MicroController Core/RXD3
GSM_COMM_EN: port GSM_COMM_EN, sheet PORT H/GSM_COMM_EN  [project net GSM_3V3_COMM_EN]
GSM_LED_EN: port GSM_LED_EN, sheet PORT H/GSM_LED_EN  [project net GSM_3V3_LED_EN]
GSM_POWER_EN: port GSM_POWER_EN, sheet PORT H/GSM_POWER_EN
MCU_LED_BLUE: port MCU_LED_BLUE, sheet PORT D/MCU_LED_BLUE
MCU_LED_EN: port MCU_LED_EN, sheet PORT D/MCU_LED_EN
MCU_LED_GREEN: port MCU_LED_GREEN, sheet PORT D/MCU_LED_GREEN
MCU_LED_RED: port MCU_LED_RED, sheet PORT D/MCU_LED_RED
POWER_DONE: port POWER_DONE, sheet PORT E/POWER_DONE
SD_MUX_DIRECTION: port SD_MUX_DIRECTION, sheet PORT E/SD_MUX_DIRECTION

### Buses and harness runs
harness port MASTER_I2C = sheet Master MicroController Core/MASTER_I2C
harness port MASTER_ICSP = sheet Master MicroController Core/MASTER_ICSP
harness port MASTER_SPI = sheet Master MicroController Core/MASTER_SPI
harness port PORT_C = sheet PORT C/PORT_C
harness port UART0 = sheet Master MicroController Core/UART0
harness port UART1 = sheet Master MicroController Core/UART1
harness port UART2 = sheet Master MicroController Core/UART2

### Notes on the sheet
- A Port of microcontroller is not used on B100 module.
- NC
- A
- F
- F Port of microcontroller is not used on B100 module.
- B
- G
- G Port of microcontroller is not used on B100 module.
- C
- ATMEGA
- H
- D
- 2560V
- J Port of microcontroller is not used on B100 module.
- J
- E
- K
- K Port of microcontroller is not used on B100 module.
- L
- L Port of microcontroller is not used on B100 module.
- © 2021 All rights reserved.
  This document may not, in whole or in part, be copied, photocopied, reproduced, translated or converted to any electronic or machine readable from without prior written permission of Mehmet Günce Akkoyun.
  Engineer contact : akkoyun@me.com
- Property of
- Engineer :
- Date :
- Size :
- A3
- Time :
- Project :
- Page :
- /
- Customer :
- Product ID :
- Module ID :
- Version :
- File :
- Revision :

## Sheet Master MicroController Port L.SchDoc: Master MicroController Port L
size 292 x 193 mm; SheetNumber: 28; SheetTotal: 44
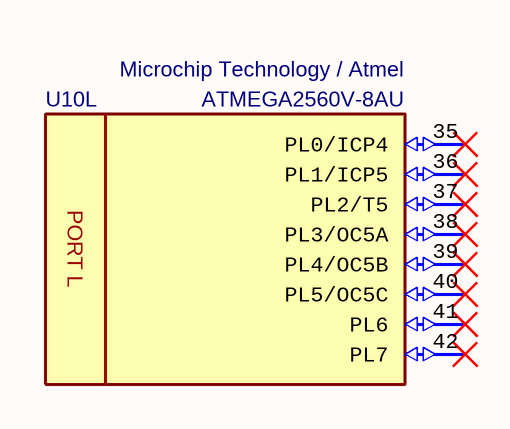
[diagram p17: Master MicroController Port L.SchDoc]

### Parts
U10  Manufacturer Part Number: ATMEGA2560V-8AU  Manufacturer Name: Microchip Technology / Atmel  [TQFP100]  (hidden comment: 8-bit MicroController)  (part L of 15)

### Nets

Not connected (* = marked no-connect by the designer): U10 35(PL0/ICP4)* 36(PL1/ICP5)* 37(PL2/T5)* 38(PL3/OC5A)* 39(PL4/OC5B)* 40(PL5/OC5C)* 41(PL6)* 42(PL7)*

### Notes on the sheet
- © 2021 All rights reserved.
  This document may not, in whole or in part, be copied, photocopied, reproduced, translated or converted to any electronic or machine readable from without prior written permission of Mehmet Günce Akkoyun.
  Engineer contact : akkoyun@me.com
- Property of
- Engineer :
- Date :
- Size :
- A4
- Time :
- Project :
- Page :
- /
- Customer :
- Product ID :
- Module ID :
- Version :
- File :
- Revision :
- (in symbol IC - ATMEGA2560V-8AU, part L) PORT L

### Library data of the parts
U10 = IC - ATMEGA2560V-8AU: 8-bit Microcontrollers - MCU 256kB Flash 4kB EEPROM 86 I/O Pins; Supply Voltage - Min: 2V7; Supply Voltage - Max: 5.5V; Height: 1mm; ComponentLink1Description: DataSheet; ComponentLink1URL: https://eu.mouser.com/datasheet/2/268/Atmel-2549-8-bit-AVR-Microcontroller-ATmega640-128-1315286.pdf; ROHS: Yes; Minimum Operating Temperature: -40; Maximum Operating Temperature: +85; ComponentLink2Description: Mouser; ComponentLink2URL: https://eu.mouser.com/ProductDetail/Microchip-Technology-Atmel/ATMEGA2560V-8AU?qs=sGAEpiMZZMutXGli8Ay4kKlCYcvZUWqJYdtgGFyqFT8%3D; Supplier 1: Digi-Key; Supplier 2: Newark; Supplier 3: Avnet; Supplier 4: RSComponents; Supplier 5: RSComponents; Supplier Part Number 1: ATMEGA2560V-8AU-ND; Supplier Part Number 2: 68T2784; Supplier Part Number 3: 68T2784; Supplier Part Number 4: 1278284P; Supplier Part Number 5: 1278284; Case: TQFP-100; Supplier 6: Mouser; Supplier 7: Future Electronics; Supplier 8: Avnet; Supplier 9: Arrow Electronics; Supplier 10: Farnell; Supplier 11: Allied Electronics; Supplier 12: Future Electronics; Supplier 13: RSComponents; Supplier 14: RSComponents; Supplier 15: RSComponents; Supplier Part Number 6: 556-ATMEGA2560V8AU; Supplier Part Number 7: 4038198; Supplier Part Number 8: ATMEGA2560V-8AU; Supplier Part Number 9: ATMEGA2560V-8AU; Supplier Part Number 10: 1288331; Supplier Part Number 11: 70124009; Supplier Part Number 12: ATMEGA2560V-8AU-TRAY; Supplier Part Number 13: 6963424; Supplier Part Number 14: 6963424P; Supplier Part Number 15: 9220809

## Sheet Master MicroController Port K.SchDoc: Master MicroController Port K
size 292 x 193 mm; SheetNumber: 27; SheetTotal: 44
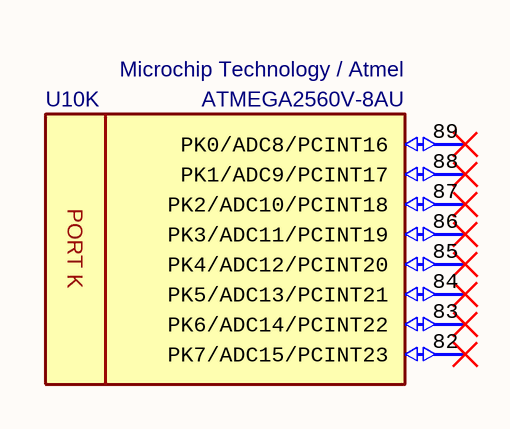
[diagram p18: Master MicroController Port K.SchDoc]

### Parts
U10  Manufacturer Part Number: ATMEGA2560V-8AU  Manufacturer Name: Microchip Technology / Atmel  [TQFP100]  (hidden comment: 8-bit MicroController)  (part K of 15)

### Nets

Not connected (* = marked no-connect by the designer): U10 82(PK7/ADC15/PCINT23)* 83(PK6/ADC14/PCINT22)* 84(PK5/ADC13/PCINT21)* 85(PK4/ADC12/PCINT20)* 86(PK3/ADC11/PCINT19)* 87(PK2/ADC10/PCINT18)* 88(PK1/ADC9/PCINT17)* 89(PK0/ADC8/PCINT16)*

### Notes on the sheet
- © 2021 All rights reserved.
  This document may not, in whole or in part, be copied, photocopied, reproduced, translated or converted to any electronic or machine readable from without prior written permission of Mehmet Günce Akkoyun.
  Engineer contact : akkoyun@me.com
- Property of
- Engineer :
- Date :
- Size :
- A4
- Time :
- Project :
- Page :
- /
- Customer :
- Product ID :
- Module ID :
- Version :
- File :
- Revision :
- (in symbol IC - ATMEGA2560V-8AU, part K) PORT K

### Library data of the parts
U10 = IC - ATMEGA2560V-8AU: as U10 on sheet Master MicroController Port L; Height: 1mm; ComponentLink1Description: DataSheet; ComponentLink1URL: https://eu.mouser.com/datasheet/2/268/Atmel-2549-8-bit-AVR-Microcontroller-ATmega640-128-1315286.pdf; ROHS: Yes; Minimum Operating Temperature: -40; Maximum Operating Temperature: +85; ComponentLink2Description: Mouser; ComponentLink2URL: https://eu.mouser.com/ProductDetail/Microchip-Technology-Atmel/ATMEGA2560V-8AU?qs=sGAEpiMZZMutXGli8Ay4kKlCYcvZUWqJYdtgGFyqFT8%3D; Supplier 1: Digi-Key; Supplier 2: Newark; Supplier 3: Avnet; Supplier 4: RSComponents; Supplier 5: RSComponents; Supplier Part Number 1: ATMEGA2560V-8AU-ND; Supplier Part Number 2: 68T2784; Supplier Part Number 3: 68T2784; Supplier Part Number 4: 1278284P; Supplier Part Number 5: 1278284; Case: TQFP-100; Supplier 6: Mouser; Supplier 7: Future Electronics; Supplier 8: Avnet; Supplier 9: Arrow Electronics; Supplier 10: Farnell; Supplier 11: Allied Electronics; Supplier 12: Future Electronics; Supplier 13: RSComponents; Supplier 14: RSComponents; Supplier 15: RSComponents; Supplier Part Number 6: 556-ATMEGA2560V8AU; Supplier Part Number 7: 4038198; Supplier Part Number 8: ATMEGA2560V-8AU; Supplier Part Number 9: ATMEGA2560V-8AU; Supplier Part Number 10: 1288331; Supplier Part Number 11: 70124009; Supplier Part Number 12: ATMEGA2560V-8AU-TRAY; Supplier Part Number 13: 6963424; Supplier Part Number 14: 6963424P; Supplier Part Number 15: 9220809

## Sheet Master MicroController Port F.SchDoc: Master MicroController Port F
size 292 x 193 mm; SheetNumber: 23; SheetTotal: 44
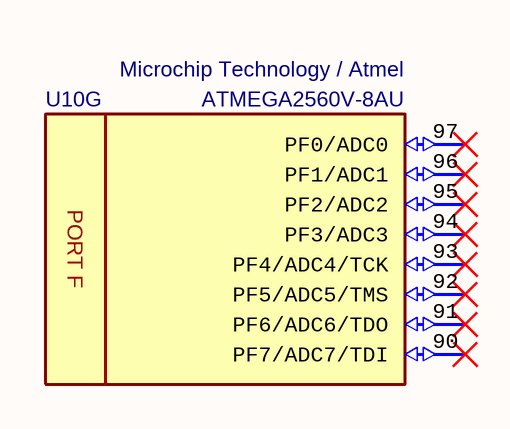
[diagram p19: Master MicroController Port F.SchDoc]

### Parts
U10  Manufacturer Part Number: ATMEGA2560V-8AU  Manufacturer Name: Microchip Technology / Atmel  [TQFP100]  (hidden comment: 8-bit MicroController)  (part G of 15)

### Nets

Not connected (* = marked no-connect by the designer): U10 90(PF7/ADC7/TDI)* 91(PF6/ADC6/TDO)* 92(PF5/ADC5/TMS)* 93(PF4/ADC4/TCK)* 94(PF3/ADC3)* 95(PF2/ADC2)* 96(PF1/ADC1)* 97(PF0/ADC0)*

### Notes on the sheet
- © 2021 All rights reserved.
  This document may not, in whole or in part, be copied, photocopied, reproduced, translated or converted to any electronic or machine readable from without prior written permission of Mehmet Günce Akkoyun.
  Engineer contact : akkoyun@me.com
- Property of
- Engineer :
- Date :
- Size :
- A4
- Time :
- Project :
- Page :
- /
- Customer :
- Product ID :
- Module ID :
- Version :
- File :
- Revision :
- (in symbol IC - ATMEGA2560V-8AU, part G) PORT F

### Library data of the parts
U10 = IC - ATMEGA2560V-8AU: as U10 on sheet Master MicroController Port L; Height: 1mm; ComponentLink1Description: DataSheet; ComponentLink1URL: https://eu.mouser.com/datasheet/2/268/Atmel-2549-8-bit-AVR-Microcontroller-ATmega640-128-1315286.pdf; ROHS: Yes; Minimum Operating Temperature: -40; Maximum Operating Temperature: +85; ComponentLink2Description: Mouser; ComponentLink2URL: https://eu.mouser.com/ProductDetail/Microchip-Technology-Atmel/ATMEGA2560V-8AU?qs=sGAEpiMZZMutXGli8Ay4kKlCYcvZUWqJYdtgGFyqFT8%3D; Supplier 1: Digi-Key; Supplier 2: Newark; Supplier 3: Avnet; Supplier 4: RSComponents; Supplier 5: RSComponents; Supplier Part Number 1: ATMEGA2560V-8AU-ND; Supplier Part Number 2: 68T2784; Supplier Part Number 3: 68T2784; Supplier Part Number 4: 1278284P; Supplier Part Number 5: 1278284; Case: TQFP-100; Supplier 6: Mouser; Supplier 7: Future Electronics; Supplier 8: Avnet; Supplier 9: Arrow Electronics; Supplier 10: Farnell; Supplier 11: Allied Electronics; Supplier 12: Future Electronics; Supplier 13: RSComponents; Supplier 14: RSComponents; Supplier 15: RSComponents; Supplier Part Number 6: 556-ATMEGA2560V8AU; Supplier Part Number 7: 4038198; Supplier Part Number 8: ATMEGA2560V-8AU; Supplier Part Number 9: ATMEGA2560V-8AU; Supplier Part Number 10: 1288331; Supplier Part Number 11: 70124009; Supplier Part Number 12: ATMEGA2560V-8AU-TRAY; Supplier Part Number 13: 6963424; Supplier Part Number 14: 6963424P; Supplier Part Number 15: 9220809

## Sheet Master MicroController Port D.SchDoc: Master MicroController Port D
size 292 x 193 mm; SheetNumber: 21; SheetTotal: 44
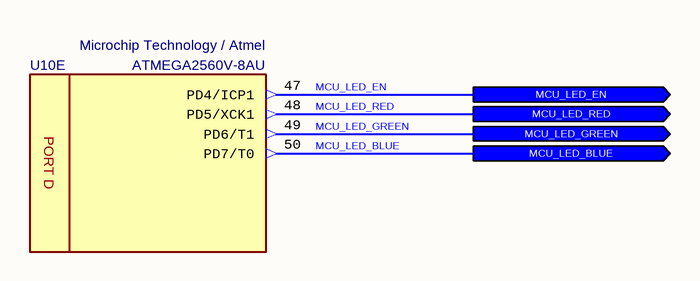
[diagram p20: Master MicroController Port D.SchDoc]

### Parts
U10  Manufacturer Part Number: ATMEGA2560V-8AU  Manufacturer Name: Microchip Technology / Atmel  [TQFP100]  (hidden comment: 8-bit MicroController)  (part E of 15)

### Ports
MCU_LED_BLUE (out), MCU_LED_EN (out), MCU_LED_GREEN (out), MCU_LED_RED (out)

### Nets
MCU_LED_BLUE: U10.50(PD7/T0) ; port MCU_LED_BLUE
MCU_LED_EN: U10.47(PD4/ICP1) ; port MCU_LED_EN
MCU_LED_GREEN: U10.49(PD6/T1) ; port MCU_LED_GREEN
MCU_LED_RED: U10.48(PD5/XCK1) ; port MCU_LED_RED

### Notes on the sheet
- © 2021 All rights reserved.
  This document may not, in whole or in part, be copied, photocopied, reproduced, translated or converted to any electronic or machine readable from without prior written permission of Mehmet Günce Akkoyun.
  Engineer contact : akkoyun@me.com
- Property of
- Engineer :
- Date :
- Size :
- A4
- Time :
- Project :
- Page :
- /
- Customer :
- Product ID :
- Module ID :
- Version :
- File :
- Revision :
- (in symbol IC - ATMEGA2560V-8AU, part E) PORT D

### Library data of the parts
U10 = IC - ATMEGA2560V-8AU: as U10 on sheet Master MicroController Port L; Height: 1mm; ComponentLink1Description: DataSheet; ComponentLink1URL: https://eu.mouser.com/datasheet/2/268/Atmel-2549-8-bit-AVR-Microcontroller-ATmega640-128-1315286.pdf; ROHS: Yes; Minimum Operating Temperature: -40; Maximum Operating Temperature: +85; ComponentLink2Description: Mouser; ComponentLink2URL: https://eu.mouser.com/ProductDetail/Microchip-Technology-Atmel/ATMEGA2560V-8AU?qs=sGAEpiMZZMutXGli8Ay4kKlCYcvZUWqJYdtgGFyqFT8%3D; Supplier 1: Digi-Key; Supplier 2: Newark; Supplier 3: Avnet; Supplier 4: RSComponents; Supplier 5: RSComponents; Supplier Part Number 1: ATMEGA2560V-8AU-ND; Supplier Part Number 2: 68T2784; Supplier Part Number 3: 68T2784; Supplier Part Number 4: 1278284P; Supplier Part Number 5: 1278284; Case: TQFP-100; Supplier 6: Mouser; Supplier 7: Future Electronics; Supplier 8: Avnet; Supplier 9: Arrow Electronics; Supplier 10: Farnell; Supplier 11: Allied Electronics; Supplier 12: Future Electronics; Supplier 13: RSComponents; Supplier 14: RSComponents; Supplier 15: RSComponents; Supplier Part Number 6: 556-ATMEGA2560V8AU; Supplier Part Number 7: 4038198; Supplier Part Number 8: ATMEGA2560V-8AU; Supplier Part Number 9: ATMEGA2560V-8AU; Supplier Part Number 10: 1288331; Supplier Part Number 11: 70124009; Supplier Part Number 12: ATMEGA2560V-8AU-TRAY; Supplier Part Number 13: 6963424; Supplier Part Number 14: 6963424P; Supplier Part Number 15: 9220809

## Sheet Master MicroController Port C.SchDoc: Master MicroController Port C
size 292 x 193 mm; SheetNumber: 20; SheetTotal: 42
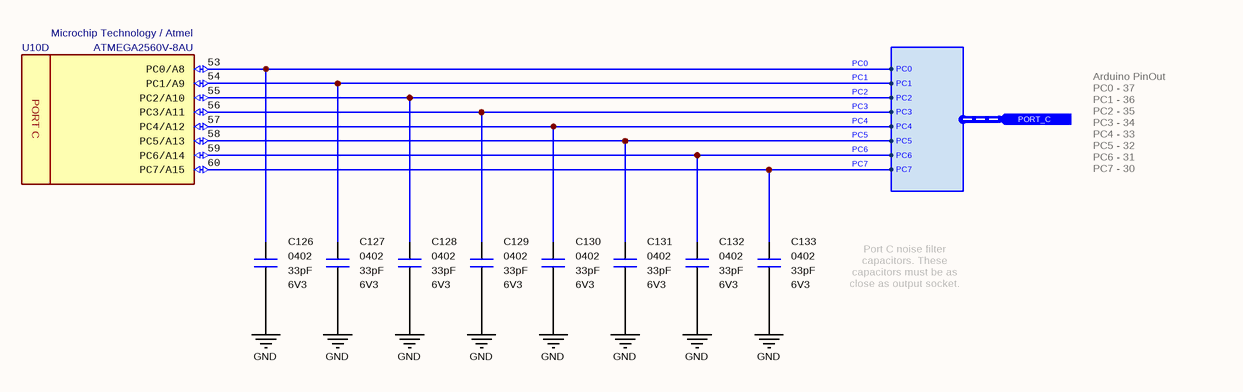
[diagram p21: Master MicroController Port C.SchDoc]

### Parts
C126  value 33pF  Case: 0402  Voltage: 6V3  [CAPACITOR_0402]  (hidden comment: Multilayer Ceramic Capacitor)
C127  value 33pF  Case: 0402  Voltage: 6V3  [CAPACITOR_0402]  (hidden comment: Multilayer Ceramic Capacitor)
C128  value 33pF  Case: 0402  Voltage: 6V3  [CAPACITOR_0402]  (hidden comment: Multilayer Ceramic Capacitor)
C129  value 33pF  Case: 0402  Voltage: 6V3  [CAPACITOR_0402]  (hidden comment: Multilayer Ceramic Capacitor)
C130  value 33pF  Case: 0402  Voltage: 6V3  [CAPACITOR_0402]  (hidden comment: Multilayer Ceramic Capacitor)
C131  value 33pF  Case: 0402  Voltage: 6V3  [CAPACITOR_0402]  (hidden comment: Multilayer Ceramic Capacitor)
C132  value 33pF  Case: 0402  Voltage: 6V3  [CAPACITOR_0402]  (hidden comment: Multilayer Ceramic Capacitor)
C133  value 33pF  Case: 0402  Voltage: 6V3  [CAPACITOR_0402]  (hidden comment: Multilayer Ceramic Capacitor)
U10  Manufacturer Part Number: ATMEGA2560V-8AU  Manufacturer Name: Microchip Technology / Atmel  [TQFP100]  (hidden comment: 8-bit MicroController)  (part D of 15)

### Ports
PORT_C (in, harness PORT_C)

### Harnesses
PORT_C: PC0, PC1, PC2, PC3, PC4, PC5, PC7, PC6

### Nets
GND: C126.1 C127.1 C128.1 C129.1 C130.1 C131.1 C132.1 C133.1
PC0: C126.2 U10.53(PC0/A8) ; port PORT_C.PC0
PC1: C127.2 U10.54(PC1/A9) ; port PORT_C.PC1
PC2: C128.2 U10.55(PC2/A10) ; port PORT_C.PC2
PC3: C129.2 U10.56(PC3/A11) ; port PORT_C.PC3
PC4: C130.2 U10.57(PC4/A12) ; port PORT_C.PC4
PC5: C131.2 U10.58(PC5/A13) ; port PORT_C.PC5
PC6: C132.2 U10.59(PC6/A14) ; port PORT_C.PC6
PC7: C133.2 U10.60(PC7/A15) ; port PORT_C.PC7

### Notes on the sheet
- Arduino PinOut
  PC0 - 37
  PC1 - 36
  PC2 - 35
  PC3 - 34
  PC4 - 33
  PC5 - 32
  PC6 - 31
  PC7 - 30
- Port C noise filter capacitors. These capacitors must be as close as output socket.
- © 2021 All rights reserved.
  This document may not, in whole or in part, be copied, photocopied, reproduced, translated or converted to any electronic or machine readable from without prior written permission of Mehmet Günce Akkoyun.
  Engineer contact : akkoyun@me.com
- Property of
- Engineer :
- Date :
- Size :
- A4
- Time :
- Project :
- Page :
- /
- Customer :
- Product ID :
- Module ID :
- Version :
- File :
- Revision :
- (in symbol IC - ATMEGA2560V-8AU, part D) PORT C

### Library data of the parts
C126-C133 = Capacitor - 33pF [0402-6V3]: Capacitor - 33pF [0402] (Ceramic); Manufacturer Name: Kemet; Manufacturer Part Number: C0402C330J9RACAUTO; Dielectric: X7R; Tolerance: 10%; Height: 0.5mm; Maximum Operating Temperature: +125; Minimum Operating Temperature: -55; ROHS: Yes; ComponentLink1Description: DataSheet; ComponentLink1URL: https://api.kemet.com/component-edge/download/datasheet/C0402C330J9RACAUTO.pdf; ComponentLink2Description: Mouser; ComponentLink2URL: https://www.mouser.com/Search/Refine.aspx?Keyword=80-C0402C330J9RAUTO; Supplier 1: Mouser; Supplier Part Number 1: 80-C0402C330J9RAUTO; Mouser Part Number: 80-C0402C330J9RAUTO
U10 = IC - ATMEGA2560V-8AU: as U10 on sheet Master MicroController Port L; Height: 1mm; ComponentLink1Description: DataSheet; ComponentLink1URL: https://eu.mouser.com/datasheet/2/268/Atmel-2549-8-bit-AVR-Microcontroller-ATmega640-128-1315286.pdf; ROHS: Yes; Minimum Operating Temperature: -40; Maximum Operating Temperature: +85; ComponentLink2Description: Mouser; ComponentLink2URL: https://eu.mouser.com/ProductDetail/Microchip-Technology-Atmel/ATMEGA2560V-8AU?qs=sGAEpiMZZMutXGli8Ay4kKlCYcvZUWqJYdtgGFyqFT8%3D; Supplier 1: Digi-Key; Supplier 2: Newark; Supplier 3: Avnet; Supplier 4: RSComponents; Supplier 5: RSComponents; Supplier Part Number 1: ATMEGA2560V-8AU-ND; Supplier Part Number 2: 68T2784; Supplier Part Number 3: 68T2784; Supplier Part Number 4: 1278284P; Supplier Part Number 5: 1278284; Case: TQFP-100; Supplier 6: Mouser; Supplier 7: Future Electronics; Supplier 8: Avnet; Supplier 9: Arrow Electronics; Supplier 10: Farnell; Supplier 11: Allied Electronics; Supplier 12: Future Electronics; Supplier 13: RSComponents; Supplier 14: RSComponents; Supplier 15: RSComponents; Supplier Part Number 6: 556-ATMEGA2560V8AU; Supplier Part Number 7: 4038198; Supplier Part Number 8: ATMEGA2560V-8AU; Supplier Part Number 9: ATMEGA2560V-8AU; Supplier Part Number 10: 1288331; Supplier Part Number 11: 70124009; Supplier Part Number 12: ATMEGA2560V-8AU-TRAY; Supplier Part Number 13: 6963424; Supplier Part Number 14: 6963424P; Supplier Part Number 15: 9220809

## Sheet Master MicroController Port B.SchDoc: Master MicroController Port B
size 292 x 193 mm; SheetNumber: 19; SheetTotal: 42
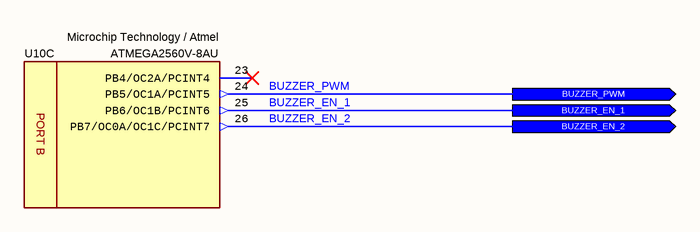
[diagram p22: Master MicroController Port B.SchDoc]

### Parts
U10  Manufacturer Part Number: ATMEGA2560V-8AU  Manufacturer Name: Microchip Technology / Atmel  [TQFP100]  (hidden comment: 8-bit MicroController)  (part C of 15)

### Ports
BUZZER_EN_1 (out), BUZZER_EN_2 (out), BUZZER_PWM (out)

### Nets
BUZZER_EN_1: U10.25(PB6/OC1B/PCINT6) ; port BUZZER_EN_1
BUZZER_EN_2: U10.26(PB7/OC0A/OC1C/PCINT7) ; port BUZZER_EN_2
BUZZER_PWM: U10.24(PB5/OC1A/PCINT5) ; port BUZZER_PWM

Not connected (* = marked no-connect by the designer): U10 23(PB4/OC2A/PCINT4)*

### Notes on the sheet
- © 2021 All rights reserved.
  This document may not, in whole or in part, be copied, photocopied, reproduced, translated or converted to any electronic or machine readable from without prior written permission of Mehmet Günce Akkoyun.
  Engineer contact : akkoyun@me.com
- Property of
- Engineer :
- Date :
- Size :
- A4
- Time :
- Project :
- Page :
- /
- Customer :
- Product ID :
- Module ID :
- Version :
- File :
- Revision :
- (in symbol IC - ATMEGA2560V-8AU, part C) PORT B

### Library data of the parts
U10 = IC - ATMEGA2560V-8AU: as U10 on sheet Master MicroController Port L; Height: 1mm; ComponentLink1Description: DataSheet; ComponentLink1URL: https://eu.mouser.com/datasheet/2/268/Atmel-2549-8-bit-AVR-Microcontroller-ATmega640-128-1315286.pdf; ROHS: Yes; Minimum Operating Temperature: -40; Maximum Operating Temperature: +85; ComponentLink2Description: Mouser; ComponentLink2URL: https://eu.mouser.com/ProductDetail/Microchip-Technology-Atmel/ATMEGA2560V-8AU?qs=sGAEpiMZZMutXGli8Ay4kKlCYcvZUWqJYdtgGFyqFT8%3D; Supplier 1: Digi-Key; Supplier 2: Newark; Supplier 3: Avnet; Supplier 4: RSComponents; Supplier 5: RSComponents; Supplier Part Number 1: ATMEGA2560V-8AU-ND; Supplier Part Number 2: 68T2784; Supplier Part Number 3: 68T2784; Supplier Part Number 4: 1278284P; Supplier Part Number 5: 1278284; Case: TQFP-100; Supplier 6: Mouser; Supplier 7: Future Electronics; Supplier 8: Avnet; Supplier 9: Arrow Electronics; Supplier 10: Farnell; Supplier 11: Allied Electronics; Supplier 12: Future Electronics; Supplier 13: RSComponents; Supplier 14: RSComponents; Supplier 15: RSComponents; Supplier Part Number 6: 556-ATMEGA2560V8AU; Supplier Part Number 7: 4038198; Supplier Part Number 8: ATMEGA2560V-8AU; Supplier Part Number 9: ATMEGA2560V-8AU; Supplier Part Number 10: 1288331; Supplier Part Number 11: 70124009; Supplier Part Number 12: ATMEGA2560V-8AU-TRAY; Supplier Part Number 13: 6963424; Supplier Part Number 14: 6963424P; Supplier Part Number 15: 9220809

## Sheet Master MicroController Port A.SchDoc: Master MicroController Port A
size 292 x 193 mm; SheetNumber: 18; SheetTotal: 44
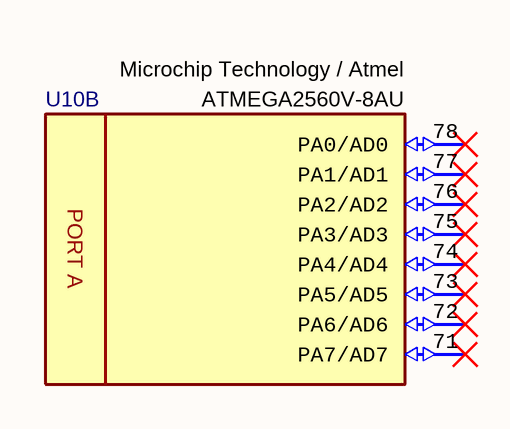
[diagram p23: Master MicroController Port A.SchDoc]

### Parts
U10  Manufacturer Part Number: ATMEGA2560V-8AU  Manufacturer Name: Microchip Technology / Atmel  [TQFP100]  (hidden comment: 8-bit MicroController)  (part B of 15)

### Nets

Not connected (* = marked no-connect by the designer): U10 71(PA7/AD7)* 72(PA6/AD6)* 73(PA5/AD5)* 74(PA4/AD4)* 75(PA3/AD3)* 76(PA2/AD2)* 77(PA1/AD1)* 78(PA0/AD0)*

### Notes on the sheet
- © 2021 All rights reserved.
  This document may not, in whole or in part, be copied, photocopied, reproduced, translated or converted to any electronic or machine readable from without prior written permission of Mehmet Günce Akkoyun.
  Engineer contact : akkoyun@me.com
- Property of
- Engineer :
- Date :
- Size :
- A4
- Time :
- Project :
- Page :
- /
- Customer :
- Product ID :
- Module ID :
- Version :
- File :
- Revision :
- (in symbol IC - ATMEGA2560V-8AU, part B) PORT A

### Library data of the parts
U10 = IC - ATMEGA2560V-8AU: as U10 on sheet Master MicroController Port L; Height: 1mm; ComponentLink1Description: DataSheet; ComponentLink1URL: https://eu.mouser.com/datasheet/2/268/Atmel-2549-8-bit-AVR-Microcontroller-ATmega640-128-1315286.pdf; ROHS: Yes; Minimum Operating Temperature: -40; Maximum Operating Temperature: +85; ComponentLink2Description: Mouser; ComponentLink2URL: https://eu.mouser.com/ProductDetail/Microchip-Technology-Atmel/ATMEGA2560V-8AU?qs=sGAEpiMZZMutXGli8Ay4kKlCYcvZUWqJYdtgGFyqFT8%3D; Supplier 1: Digi-Key; Supplier 2: Newark; Supplier 3: Avnet; Supplier 4: RSComponents; Supplier 5: RSComponents; Supplier Part Number 1: ATMEGA2560V-8AU-ND; Supplier Part Number 2: 68T2784; Supplier Part Number 3: 68T2784; Supplier Part Number 4: 1278284P; Supplier Part Number 5: 1278284; Case: TQFP-100; Supplier 6: Mouser; Supplier 7: Future Electronics; Supplier 8: Avnet; Supplier 9: Arrow Electronics; Supplier 10: Farnell; Supplier 11: Allied Electronics; Supplier 12: Future Electronics; Supplier 13: RSComponents; Supplier 14: RSComponents; Supplier 15: RSComponents; Supplier Part Number 6: 556-ATMEGA2560V8AU; Supplier Part Number 7: 4038198; Supplier Part Number 8: ATMEGA2560V-8AU; Supplier Part Number 9: ATMEGA2560V-8AU; Supplier Part Number 10: 1288331; Supplier Part Number 11: 70124009; Supplier Part Number 12: ATMEGA2560V-8AU-TRAY; Supplier Part Number 13: 6963424; Supplier Part Number 14: 6963424P; Supplier Part Number 15: 9220809